# EAGLE design Development board (EAGLE 8.0.1)
CREVISION: V1; DESIGNER: Henrik K. B. Jensen

## Sheet 1 of 2
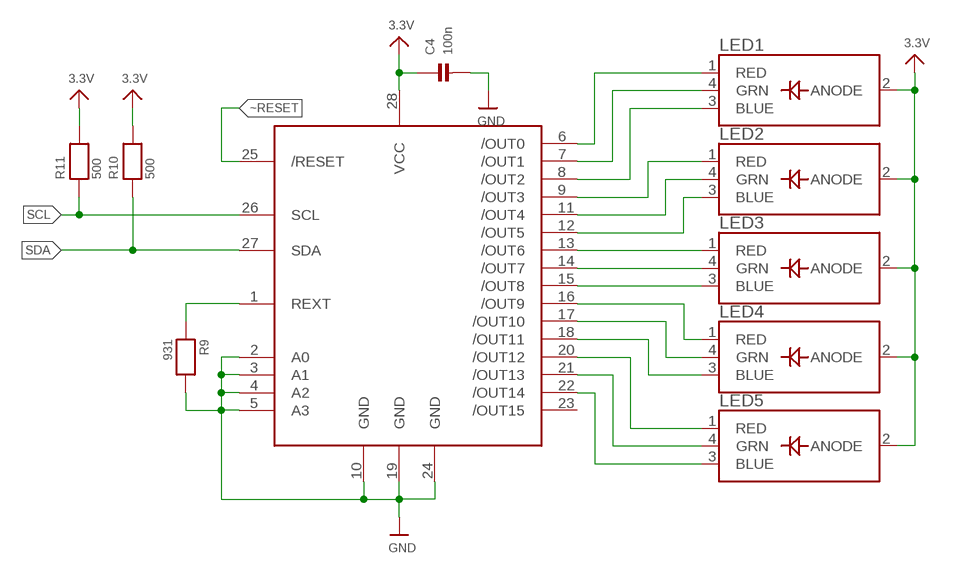
[diagram p0: schematic, sheet 1, part 1 of 3]
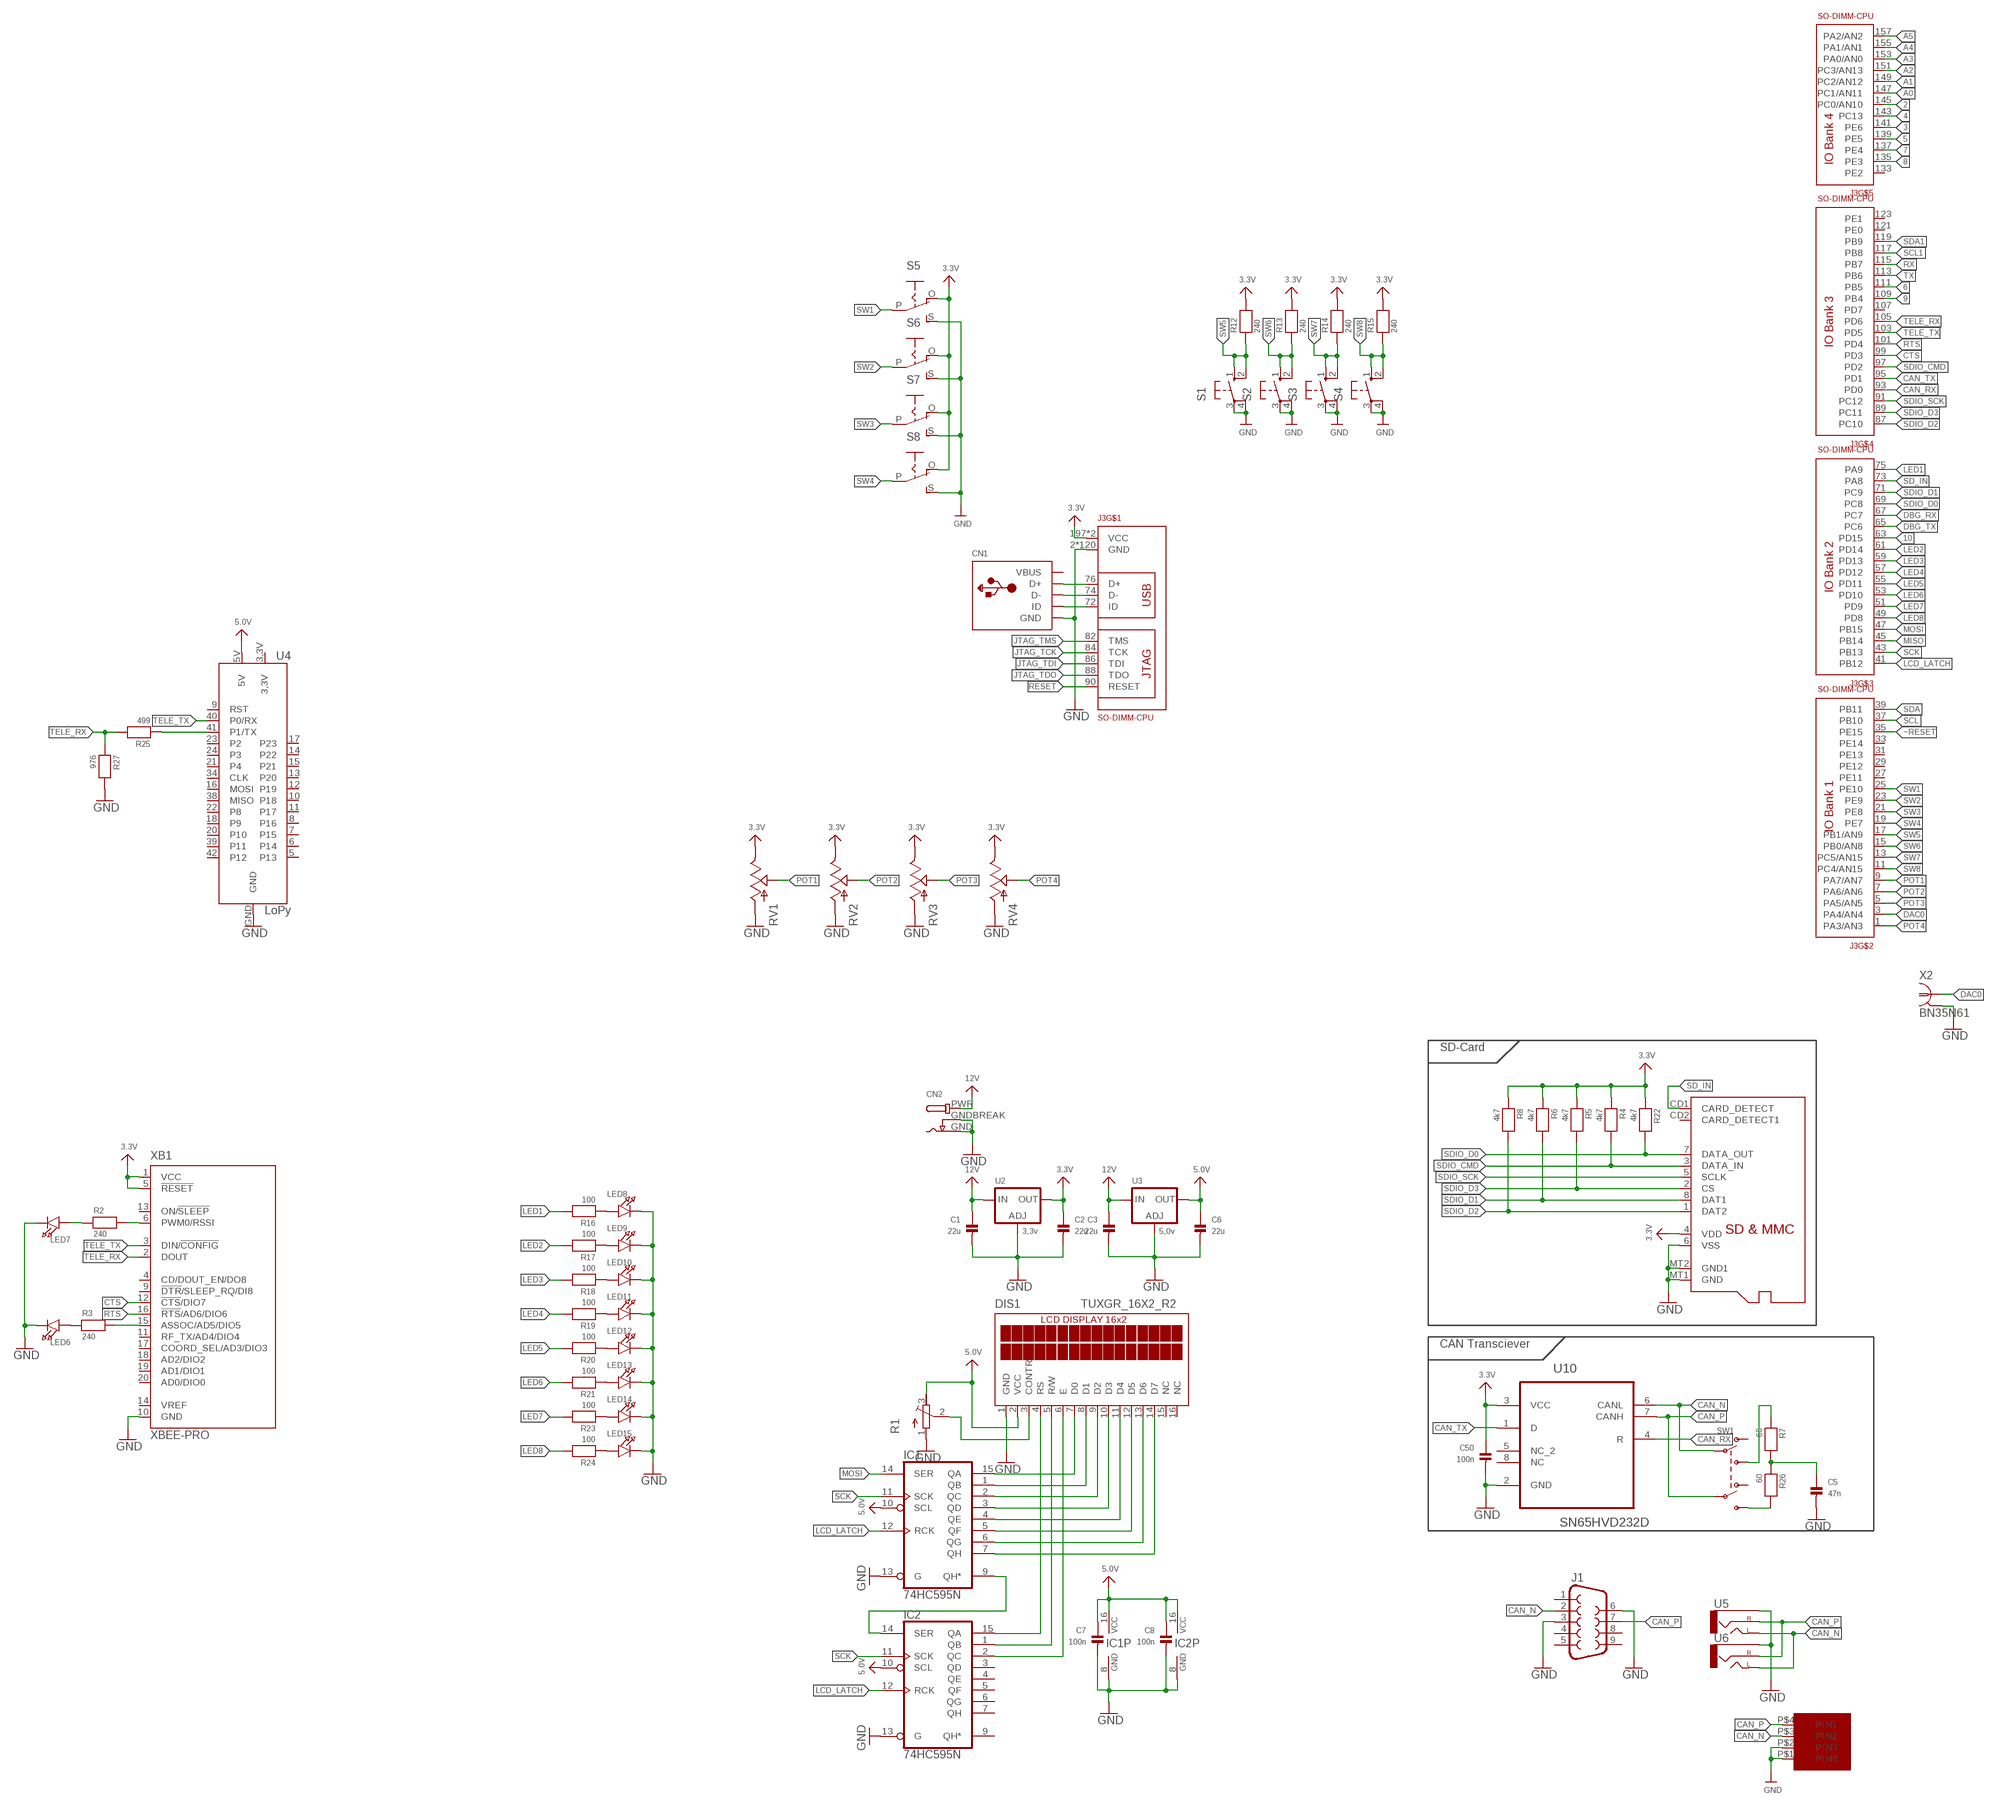
[diagram p1: schematic, sheet 1, part 2 of 3]
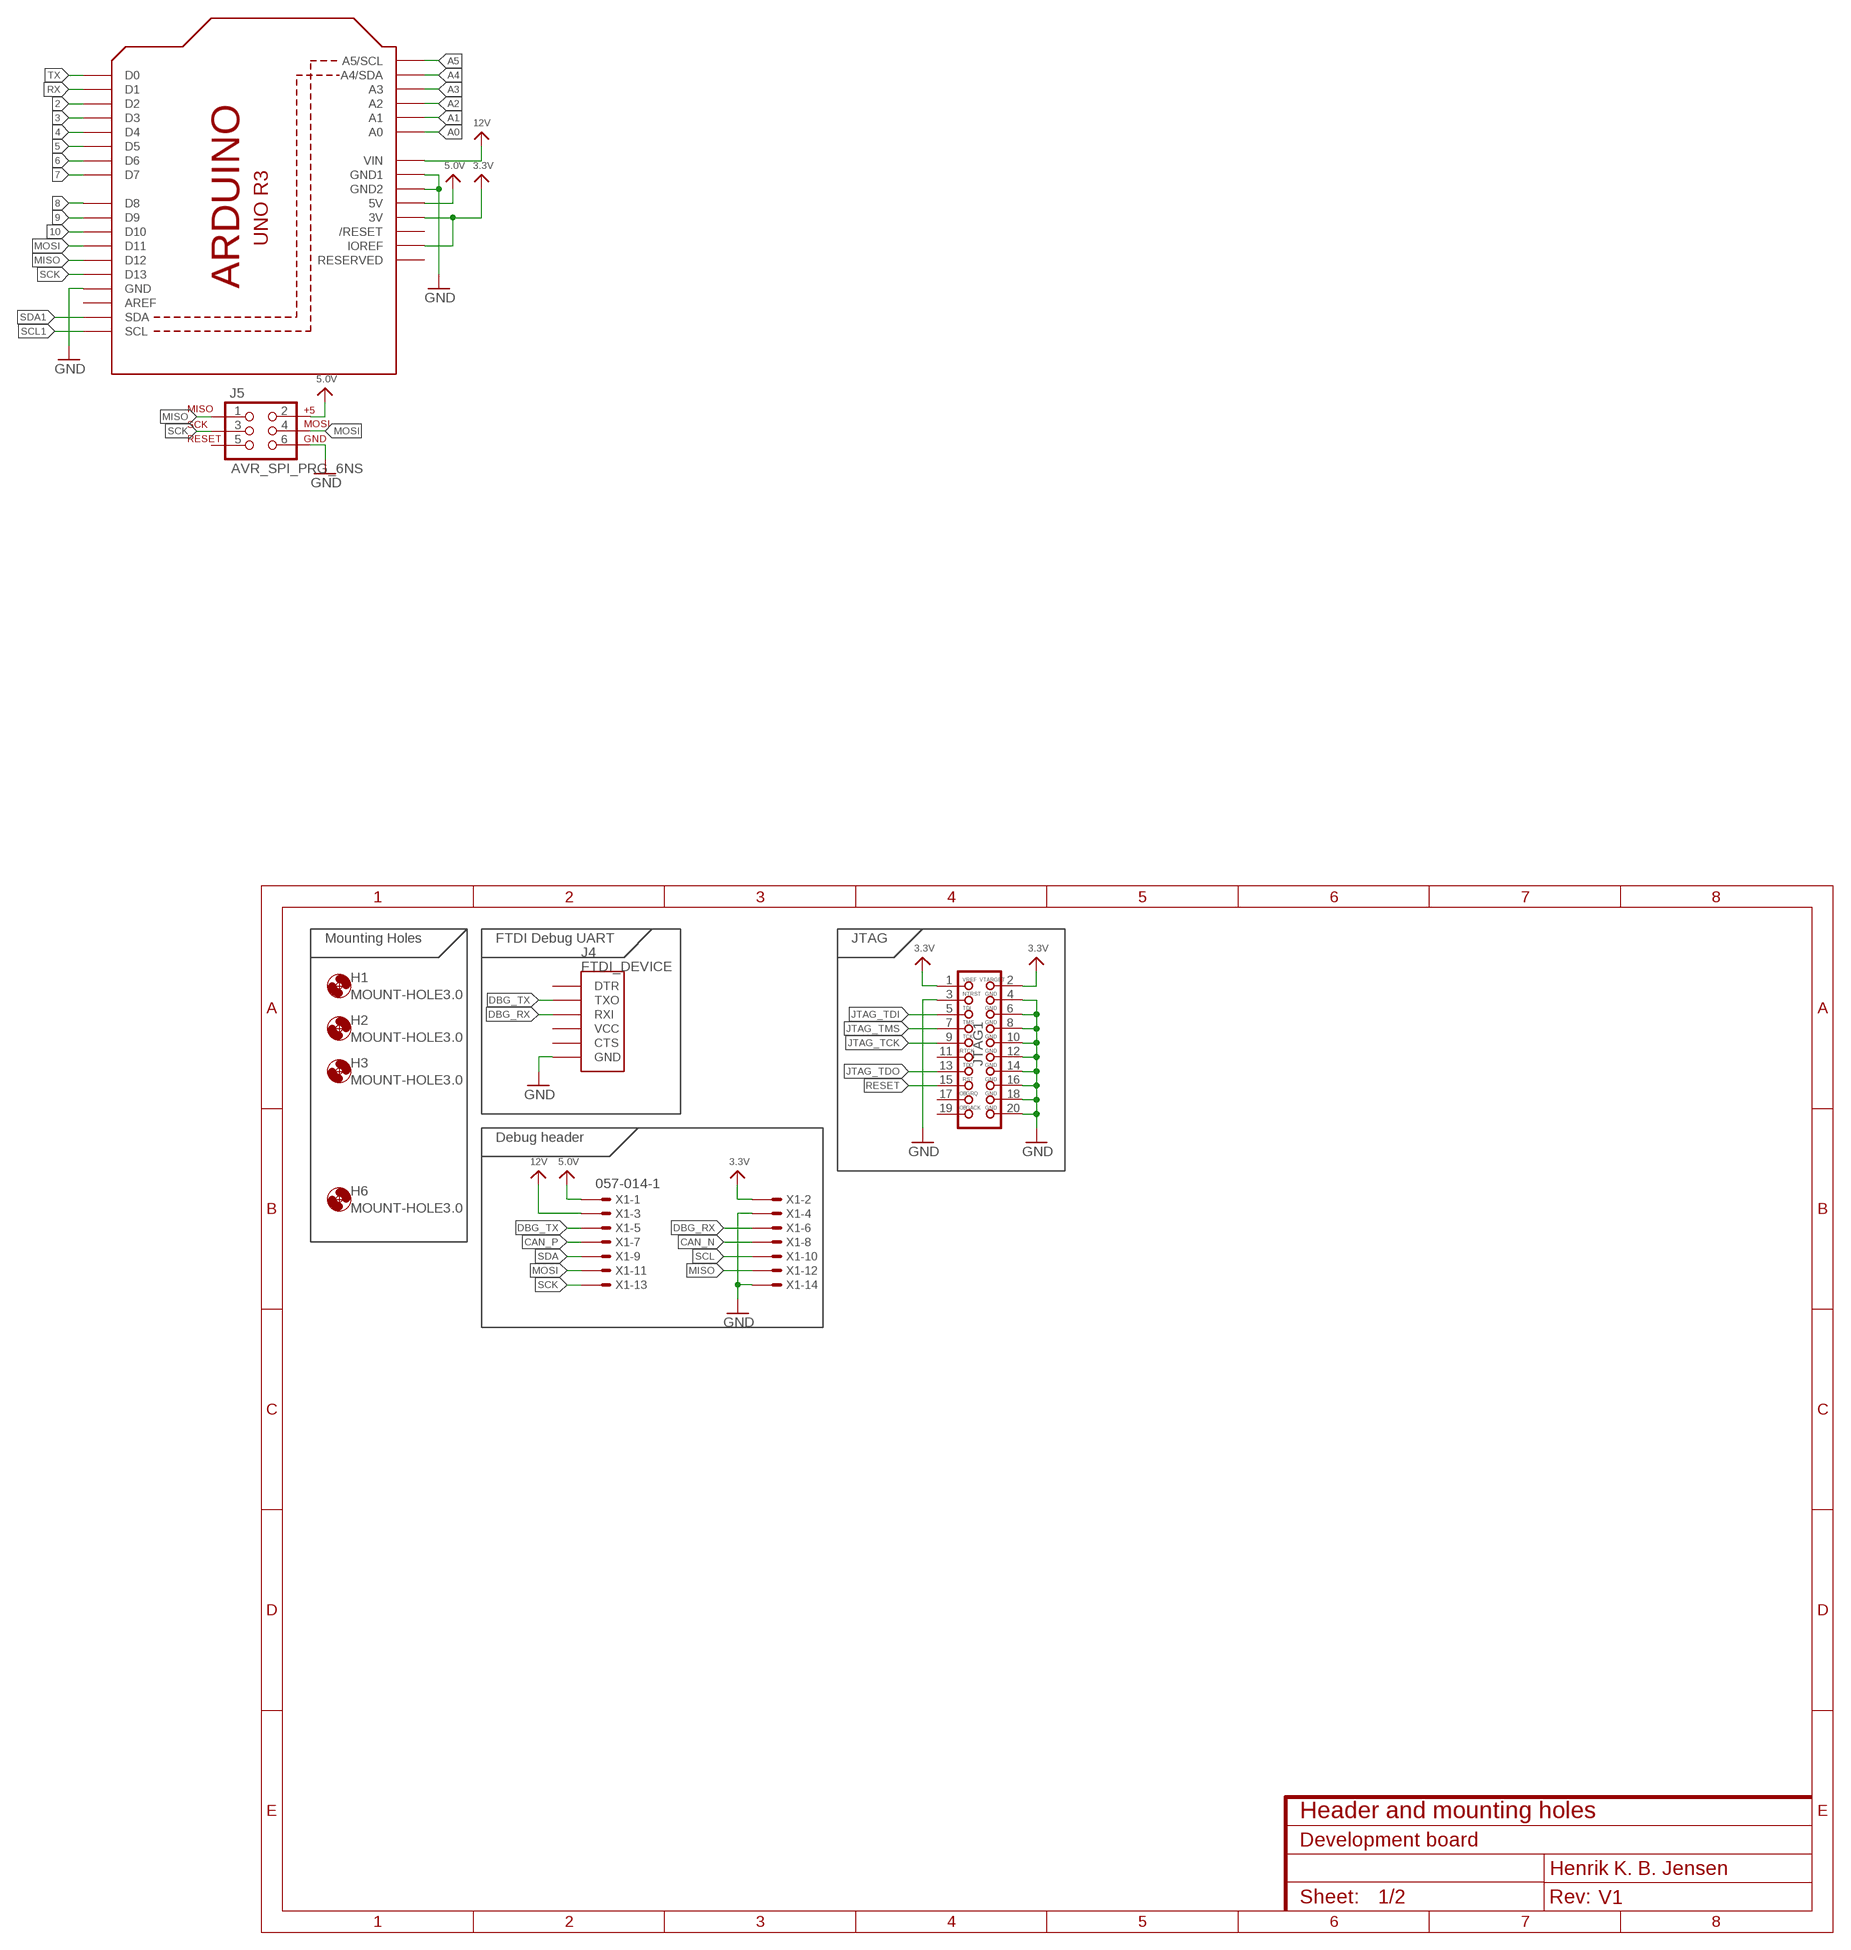
[diagram p2: schematic, sheet 1, part 3 of 3]

### Parts
C1  22u  CAP_CERAMIC_0805  [_0805]
C2  22u  CAP_CERAMIC_0805  [_0805]
C3  22u  CAP_CERAMIC_0805  [_0805]
C4  100n  CAP_CERAMIC_0603  [_0603]
C5  47n  CAP_CERAMIC_0603  [_0603]
C6  22u  CAP_CERAMIC_0805  [_0805]
C7  100n  CAP_CERAMIC_0603  [_0603]
C8  100n  CAP_CERAMIC_0603  [_0603]
C50  100n  CAP_CERAMIC_0603  [_0603]
CN1  USBMINIBLARGE  [USB-MINIB_LARGER]
CN2  DCBARRELPTH  [DCJACK_2MM_PTH]
DIS1  TUXGR_16X2_R2  [TUXGR_16X2_R2]
H1  MOUNT-HOLE3.0  [3,0]
H2  MOUNT-HOLE3.0  [3,0]
H3  MOUNT-HOLE3.0  [3,0]
H6  MOUNT-HOLE3.0  [3,0]
IC1  74HC595N  [DIL16]
IC2  74HC595N  [DIL16]
J1  DB9FEMALE  [DB9]
J3  SO-DIMM-CPU  [SODIMM-CONNECTOR-2.5V]
J4  FTDI_DEVICE  [FTDI_DEVICE_SIDE]
J5  AVR_SPI_PRG_6NS  [2X3-NS]
JTAG1  JTAG-ARM  [JTAG-ARM]
LED1  LED_RGB_PLCC4  [RGBLED_PLCC4]
LED2  LED_RGB_PLCC4  [RGBLED_PLCC4]
LED3  LED_RGB_PLCC4  [RGBLED_PLCC4]
LED4  LED_RGB_PLCC4  [RGBLED_PLCC4]
LED5  LED_RGB_PLCC4  [RGBLED_PLCC4]
LED6  LED1206  [CHIPLED_1206]
LED7  LED1206  [CHIPLED_1206]
LED8  LED1206  [CHIPLED_1206]
LED9  LED1206  [CHIPLED_1206]
LED10  LED1206  [CHIPLED_1206]
LED11  LED1206  [CHIPLED_1206]
LED12  LED1206  [CHIPLED_1206]
LED13  LED1206  [CHIPLED_1206]
LED14  LED1206  [CHIPLED_1206]
LED15  LED1206  [CHIPLED_1206]
R1  R-TRIMM3296W  [RTRIM3296W]
R2  240  RESISTOR_0603  [_0603]
R3  240  RESISTOR_0603  [_0603]
R4  4k7  RESISTOR_0603  [_0603]
R5  4k7  RESISTOR_0603  [_0603]
R6  4k7  RESISTOR_0603  [_0603]
R7  60  RESISTOR_0603  [_0603]
R8  4k7  RESISTOR_0603  [_0603]
R9  931  RESISTOR_0603  [_0603]
R10  500  RESISTOR_0603  [_0603]
R11  500  RESISTOR_0603  [_0603]
R12  240  RESISTOR_0603  [_0603]
R13  240  RESISTOR_0603  [_0603]
R14  240  RESISTOR_0603  [_0603]
R15  240  RESISTOR_0603  [_0603]
R16  100  RESISTOR_0603  [_0603]
R17  100  RESISTOR_0603  [_0603]
R18  100  RESISTOR_0603  [_0603]
R19  100  RESISTOR_0603  [_0603]
R20  100  RESISTOR_0603  [_0603]
R21  100  RESISTOR_0603  [_0603]
R22  4k7  RESISTOR_0603  [_0603]
R23  100  RESISTOR_0603  [_0603]
R24  100  RESISTOR_0603  [_0603]
R25  499  RESISTOR_0603  [_0603]
R26  60  RESISTOR_0603  [_0603]
R27  976  RESISTOR_0603  [_0603]
RV1  POT  [ALPS_POT]
RV2  POT  [ALPS_POT]
RV3  POT  [ALPS_POT]
RV4  POT  [ALPS_POT]
S1  10-XX  [B3F-10XX]
S2  10-XX  [B3F-10XX]
S3  10-XX  [B3F-10XX]
S4  10-XX  [B3F-10XX]
S5  EG1218S  [EG1218]
S6  EG1218S  [EG1218]
S7  EG1218S  [EG1218]
S8  EG1218S  [EG1218]
SW1  SWITCH_DPDT  [DPDT_SMT_JS202011SCQN]
U1  ARDUINOR3-DIMENSION  [ARDUINOR3]
U2  3,3v  LM1117SOT223-REFLOW  [SOT223-R]
U3  5,0v  LM1117SOT223-REFLOW  [SOT223-R]
U4  LoPy  LOPY  [LOPY]
U5  AUDIO-JACKPTH  [AUDIO-JACK]
U6  AUDIO-JACKPTH  [AUDIO-JACK]
U10  SN65HVD232D  [SOIC127P600X175-8N]
U$2  MICROSD  [MICROSD]
U$21  MICROFIT4  [43045-0400]
U$30  TLC59116  [TSSOP28]
X1  057-014-1  [057-014-1]
X2  BN35N61  [B35N61]
XB1  XBEE-PRO  [XBEE-PRO]

### Nets
2: J3.145(PC0/AN10) U1.D2
3: J3.141(PE6) U1.D3
3.3V: C2.1 C4.1 C50.1 J3.197(VCC) J3.199(VCC) JTAG1.1 JTAG1.2 LED1.2(ANODE) LED2.2(ANODE) LED3.2(ANODE) LED4.2(ANODE) LED5.2(ANODE) R4.1 R5.1 R6.1 R8.1 R10.2 R11.2 R12.2 R13.2 R14.2 R15.2 R22.1 RV1.P$1(E) RV2.P$1(E) RV3.P$1(E) RV4.P$1(E) S5.O S6.O S7.O S8.O U1.3V U1.IOREF U2.2(OUT) U10.3(VCC) U$2.4(VDD) U$30.28(VCC) X1.2 XB1.1(VCC) XB1.5(!RESET)
4: J3.143(PC13) U1.D4
5: J3.139(PE5) U1.D5
5.0V: C6.1 C7.1 C8.1 DIS1.2(VCC) IC1.10(SCL) IC1.16(VCC) IC2.10(SCL) IC2.16(VCC) J5.2 R1.3(E) U1.5V U3.2(OUT) U4.5V X1.1
6: J3.111(PB5) U1.D6
7: J3.137(PE4) U1.D7
8: J3.135(PE3) U1.D8
9: J3.109(PB4) U1.D9
10: J3.63(PD15) U1.D10
12V: C1.1 C3.1 CN2.PWR U1.VIN U2.3(IN) U3.3(IN) X1.3
_N: CN1.D- J3.74(D-)
_P: CN1.D+ J3.76(D+)
A0: J3.147(PC1/AN11) U1.A0
A1: J3.149(PC2/AN12) U1.A1
A2: J3.151(PC3/AN13) U1.A2
A3: J3.153(PA0/AN0) U1.A3
A4: J3.155(PA1/AN1) U1.A4(A4/SDA)
A5: J3.157(PA2/AN2) U1.A5(A5/SCL)
CAN_N: J1.2 SW1.P$2(P1) U5.TIP(LEFT) U6.TIP(LEFT) U10.6(CANL) U$21.P$3(PIN2) X1.8
CAN_P: J1.7 SW1.P$5(P2) U5.RING(RIGHT) U6.RING(RIGHT) U10.7(CANH) U$21.P$4(PIN1) X1.7
CAN_RX: J3.93(PD0) U10.4(R)
CAN_TX: J3.95(PD1) U10.1(D)
CTS: J3.99(PD3) XB1.12(!CTS!/DIO7)
DAC0: J3.3(PA4/AN4) X2.1
DBG_RX: J3.67(PC7) J4.P$3(RXI) X1.6
DBG_TX: J3.65(PC6) J4.P$2(TXO) X1.5
GND: C1.2 C2.2 C3.2 C4.2 C5.2 C6.2 C7.2 C8.2 C50.2 CN1.GND CN2.GND CN2.GNDBREAK DIS1.1(GND) IC1.8(GND) IC1.13(G) IC2.8(GND) IC2.13(G) J1.3 J1.6 J3.2(GND) J3.4(GND) J3.6(GND) J3.8(GND) J3.10(GND) J3.12(GND) J3.14(GND) J3.16(GND) J3.18(GND) J3.20(GND) J3.22(GND) J3.24(GND) J3.26(GND) J3.28(GND) J3.30(GND) J3.32(GND) J3.34(GND) J3.36(GND) J3.38(GND) J3.40(GND) J3.42(GND) J3.44(GND) J3.46(GND) J3.48(GND) J3.50(GND) J3.52(GND) J3.54(GND) J3.56(GND) J3.58(GND) J3.60(GND) J3.62(GND) J3.64(GND) J3.66(GND) J3.68(GND) J3.70(GND) J3.77(GND) J3.78(GND) J3.79(GND) J3.80(GND) J3.81(GND) J3.83(GND) J3.85(GND) J3.92(GND) J3.94(GND) J3.96(GND) J3.98(GND) J3.100(GND) J3.102(GND) J3.104(GND) J3.106(GND) J3.108(GND) J3.110(GND) J3.112(GND) J3.114(GND) J3.116(GND) J3.118(GND) J3.120(GND) J3.122(GND) J3.124(GND) J3.125(GND) J3.126(GND) J3.127(GND) J3.128(GND) J3.129(GND) J3.130(GND) J3.131(GND) J3.132(GND) J3.134(GND) J3.136(GND) J3.138(GND) J3.140(GND) J3.142(GND) J3.144(GND) J3.146(GND) J3.148(GND) J3.150(GND) J3.152(GND) J3.154(GND) J3.156(GND) J3.158(GND) J3.159(GND) J3.160(GND) J3.161(GND) J3.162(GND) J3.163(GND) J3.164(GND) J3.165(GND) J3.166(GND) J3.167(GND) J3.168(GND) J3.169(GND) J3.170(GND) J3.171(GND) J3.172(GND) J3.173(GND) J3.174(GND) J3.175(GND) J3.176(GND) J3.177(GND) J3.178(GND) J3.179(GND) J3.180(GND) J3.181(GND) J3.182(GND) J3.183(GND) J3.184(GND) J3.185(GND) J3.186(GND) J3.187(GND) J3.188(GND) J3.189(GND) J3.190(GND) J3.191(GND) J3.192(GND) J3.193(GND) J3.194(GND) J3.195(GND) J3.196(GND) J3.198(GND) J3.200(GND) J4.P$6(GND) J5.6 JTAG1.3 JTAG1.4 JTAG1.6 JTAG1.8 JTAG1.10 JTAG1.12 JTAG1.14 JTAG1.16 JTAG1.18 JTAG1.20 LED6.C LED7.C LED8.C LED9.C LED10.C LED11.C LED12.C LED13.C LED14.C LED15.C R1.1(A) R9.2 R27.2 RV1.P$3(A) RV2.P$3(A) RV3.P$3(A) RV4.P$3(A) S1.3(P) S1.4(P1) S2.3(P) S2.4(P1) S3.3(P) S3.4(P1) S4.3(P) S4.4(P1) S5.S S6.S S7.S S8.S U1.GND U1.GND1 U1.GND2 U2.1(ADJ) U3.1(ADJ) U4.GND U5.SLEEVE U6.SLEEVE U10.2(GND) U$2.6(VSS) U$2.MT1(GND) U$2.MT2(GND1) U$21.P$1(PIN4) U$21.P$2(PIN3) U$30.2(A0) U$30.3(A1) U$30.4(A2) U$30.5(A3) U$30.10(GND) U$30.19(GND) U$30.24(GND) X1.4 X1.14 X2.2(GND) XB1.10(GND)
JTAG_TCK: J3.84(TCK) JTAG1.9
JTAG_TDI: J3.86(TDI) JTAG1.5
JTAG_TDO: J3.88(TDO) JTAG1.13
JTAG_TMS: J3.82(TMS) JTAG1.7
LCD_LATCH: IC1.12(RCK) IC2.12(RCK) J3.41(PB12)
LED1: J3.75(PA9) R16.2
LED2: J3.61(PD14) R17.2
LED3: J3.59(PD13) R18.2
LED4: J3.57(PD12) R19.2
LED5: J3.55(PD11) R20.2
LED6: J3.53(PD10) R21.2
LED7: J3.51(PD9) R23.2
LED8: J3.49(PD8) R24.2
MISO: J3.45(PB14) J5.1 U1.D12 X1.12
MOSI: IC1.14(SER) J3.47(PB15) J5.4 U1.D11 X1.11
N$1: DIS1.7(D0) IC1.15(QA)
N$2: DIS1.8(D1) IC1.1(QB)
N$3: R7.1 SW1.P$3(S1)
N$4: DIS1.9(D2) IC1.2(QC)
N$5: R26.2 SW1.P$4(S2)
N$6: DIS1.10(D3) IC1.3(QD)
N$7: DIS1.11(D4) IC1.4(QE)
N$8: C5.1 R7.2 R26.1
N$9: DIS1.12(D5) IC1.5(QF)
N$10: LED1.1(RED) U$30.6(/OUT0)
N$11: DIS1.3(CONTR) R1.2(S)
N$12: LED8.A R16.1
N$13: LED1.4(GRN) U$30.7(/OUT1)
N$14: LED1.3(BLUE) U$30.8(/OUT2)
N$15: LED9.A R17.1
N$16: LED6.A R3.1
N$17: R3.2 XB1.15(ASSOC/AD5/DIO5)
N$18: R2.2 XB1.6(PWM0/RSSI)
N$19: LED7.A R2.1
N$20: LED2.1(RED) U$30.9(/OUT3)
N$21: LED2.4(GRN) U$30.11(/OUT4)
N$22: LED2.3(BLUE) U$30.12(/OUT5)
N$23: DIS1.13(D6) IC1.6(QG)
N$24: DIS1.14(D7) IC1.7(QH)
N$25: LED10.A R18.1
N$26: LED11.A R19.1
N$27: IC1.9(QH*) IC2.14(SER)
N$28: DIS1.4(RS) IC2.15(QA)
N$29: LED3.1(RED) U$30.13(/OUT6)
N$30: LED3.4(GRN) U$30.14(/OUT7)
N$31: LED12.A R20.1
N$32: LED3.3(BLUE) U$30.15(/OUT8)
N$33: LED4.1(RED) U$30.16(/OUT9)
N$34: LED4.4(GRN) U$30.17(/OUT10)
N$35: LED4.3(BLUE) U$30.18(/OUT11)
N$36: LED5.1(RED) U$30.20(/OUT12)
N$37: DIS1.5(R/W) IC2.1(QB)
N$38: LED5.4(GRN) U$30.21(/OUT13)
N$39: LED5.3(BLUE) U$30.22(/OUT14)
N$40: DIS1.6(E) IC2.2(QC)
N$41: LED13.A R21.1
N$42: LED14.A R23.1
N$43: LED15.A R24.1
N$46: R25.1 U4.41(P1/TX)
N$53: R9.1 U$30.1(REXT)
N$79: CN1.ID J3.72(ID)
POT1: J3.9(PA7/AN7) RV1.P$2(S)
POT2: J3.7(PA6/AN6) RV2.P$2(S)
POT3: J3.5(PA5/AN5) RV3.P$2(S)
POT4: J3.1(PA3/AN3) RV4.P$2(S)
RESET: J3.90(RESET) JTAG1.15
RTS: J3.101(PD4) XB1.16(!RTS!/AD6/DIO6)
RX: J3.115(PB7) U1.D1
SCK: IC1.11(SCK) IC2.11(SCK) J3.43(PB13) J5.3 U1.D13 X1.13
SCL: J3.37(PB10) R11.1 U$30.26(SCL) X1.10
SCL1: J3.117(PB8) U1.SCL
SD_IN: J3.73(PA8) U$2.CD1(CARD_DETECT)
SDA: J3.39(PB11) R10.1 U$30.27(SDA) X1.9
SDA1: J3.119(PB9) U1.SDA
SDIO_CMD: J3.97(PD2) R4.2 U$2.3(DATA_IN)
SDIO_D0: J3.69(PC8) R22.2 U$2.7(DATA_OUT)
SDIO_D1: J3.71(PC9) R6.2 U$2.8(DAT1)
SDIO_D2: J3.87(PC10) R8.2 U$2.1(DAT2)
SDIO_D3: J3.89(PC11) R5.2 U$2.2(CS)
SDIO_SCK: J3.91(PC12) U$2.5(SCLK)
SW1: J3.25(PE10) S5.P
SW2: J3.23(PE9) S6.P
SW3: J3.21(PE8) S7.P
SW4: J3.19(PE7) S8.P
SW5: J3.17(PB1/AN9) R12.1 S1.1(S) S1.2(S1)
SW6: J3.15(PB0/AN8) R13.1 S2.1(S) S2.2(S1)
SW7: J3.13(PC5/AN15) R14.1 S3.1(S) S3.2(S1)
SW8: J3.11(PC4/AN15) R15.1 S4.1(S) S4.2(S1)
TELE_RX: J3.105(PD6) R25.2 R27.1 XB1.2(DOUT)
TELE_TX: J3.103(PD5) U4.40(P0/RX) XB1.3(DIN/!CONFIG)
TX: J3.113(PB6) U1.D0
~RESET: J3.35(PE15) U$30.25(/RESET)
Unconnected: DIS1.15(NC) DIS1.16(NC) IC2.3(QD) IC2.4(QE) IC2.5(QF) IC2.6(QG) IC2.7(QH) IC2.9(QH*) J1.1 J1.4 J1.5 J1.8 J1.9 J3.27(PE11) J3.29(PE12) J3.31(PE13) J3.33(PE14) J3.107(PD7) J3.121(PE0) J3.123(PE1) J3.133(PE2) J4.P$1(DTR) J4.P$4(VCC) J4.P$5(CTS) J5.5 JTAG1.11 JTAG1.17 JTAG1.19 SW1.P$1(O1) SW1.P$6(O2) U1.AREF U1.RESERVED U1.RESET(/RESET) U4.3,3V U4.5(P13) U4.6(P14) U4.7(P15) U4.8(P16) U4.9(RST) U4.10(P18) U4.11(P17) U4.12(P19) U4.13(P20) U4.14(P22) U4.15(P21) U4.16(MOSI) U4.17(P23) U4.18(P9) U4.20(P10) U4.21(P4) U4.22(P8) U4.23(P2) U4.24(P3) U4.34(CLK) U4.38(MISO) U4.39(P11) U4.42(P12) U10.5(NC_2) U10.8(NC) U$2.CD2(CARD_DETECT1) U$30.23(/OUT15) XB1.4(CD/DOUT_EN/DO8) XB1.9(!DTR!/SLEEP_RQ/DI8) XB1.11(RF_TX/AD4/DIO4) XB1.13(ON/!SLEEP) XB1.14(VREF) XB1.17(COORD_SEL/AD3/DIO3) XB1.18(AD2/DIO2) XB1.19(AD1/DIO1) XB1.20(AD0/DIO0)

### Notes on the sheet
- Mounting Holes | FTDI Debug UART | JTAG
- Debug header
- SD-Card
- CAN Transciever
- Header and mounting holes

## Sheet 2 of 2
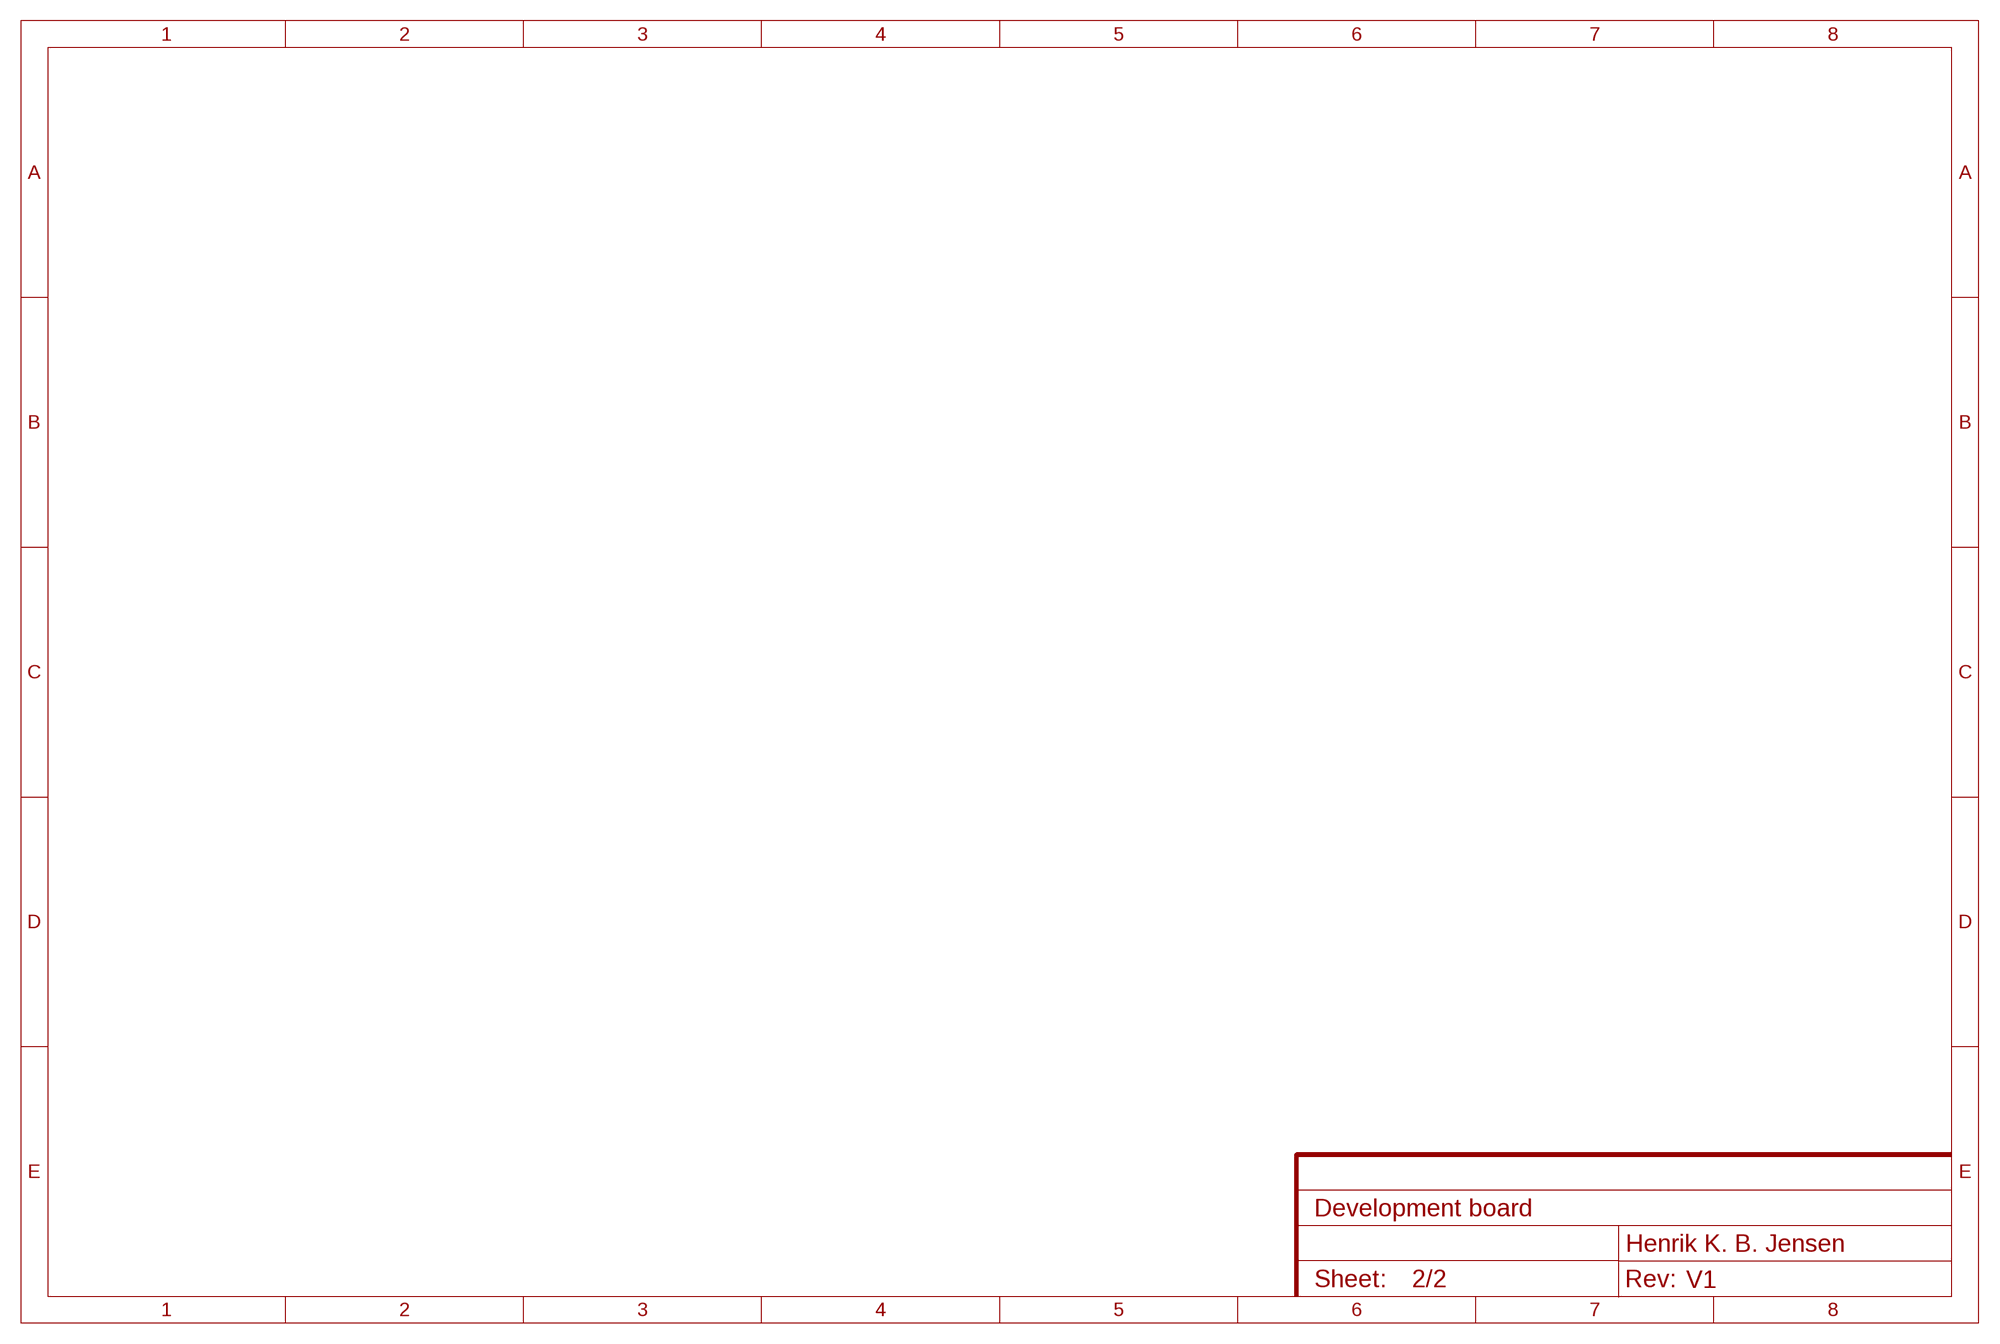
[diagram p3: schematic, sheet 2]

## Power pins joined to a net without a drawn wire
GND: X2.3(GND) X2.4(GND) X2.5(GND)
VBUS: CN1.VBUS

## Library data of the parts
C1-C8 C50 = microbuilder:CAP_CERAMIC: Ceramic Capacitors 0402 - 0402 Surface Mount Capacitors 16pF 50V 5% [Digikey: 445-4899-2-ND] 18pF 50V 5% [Digikey: 490-1281-2-ND] 22pF 50V 5% [Digikey: 490-1283-2-ND] 68pF 50V 5% [Digikey: 490-1289-2-ND] 0.1uF 10V 10% [Digikey: 490-1318-2-ND] 1.0uF 6.3V 10% [Digikey: 490-1320-2-ND] 0603 - 0603 Surface Mount Capacitors 16 pF 50V 5% [Digikey: 445-5051-2-ND] 22 pF 50V [Digikey: PCC220ACVTR-ND] 33 pF 50V 5% [Digikey: 490-1415-1-ND] 56pF 50V 5% [Digikey: 490-1421-1-ND] 220pF 50V 5% [Digikey: 445-1285-1-ND] 680 pF 50V 2200 pF 50V 5% C0G [Digikey: 445-1297-1-ND] 5600 pF 100V 5% X7R [Digikey: 478-3711-1-ND] 0.1 µF 25V 10% [Digikey: PCC2277TR-ND] 0.22 µF 16V 10% X7R [Digikey: 445-1318-1-ND] 1.0 µF 25V 10% [Digikey: 445-5146-2-ND] 0603 - RF Specific 3pF 250V +/-0.1pF RF [Digikey: 712-1347-1-ND] 18 pF 250V 5% [Digikey: 478-3505-1-ND or 712-1322-1-ND] 56 pF 250V 5% C0G RF [Digikey: 490-4867-1-ND] 68 pF 250V RF [Digikey: 490-4868-1-ND] 0805 - 0805 Surface Mount Capacitors 220 pF 250V 2% RF Ceramic Capacitor [Digikey: 712-1398-1-ND] 1000 pF 50V 2% NP0 Ceramic Capacitor [Digikey: 478-3760-1-ND] 0.1 µF 25V 10% Ceramic Capacitor [Digikey: PCC1828TR-ND] 1.0 µF 16V 10% Ceramic Capacitor[Digikey: 490-1691-2-ND] 10.0 µF 10V 10% Ceramic Capacitor[Digikey: 709-1228-1-ND] 10.0 uF 16V 10% Ceramic Capacitor [Digikey: 478-5165-2-ND] 47 uF 6.3V 20% Ceramic Capacitor [Digikey: 587-1779-1-ND or 399-5506-1-ND] 1206 - 1206 Surface Mount Capacitors 47uF 10V 20% Ceramic Capacitor [Digikey: 490-5528-1-ND or 399-5508-1-ND or 445-6010-1-ND] 100uF 6.3V -20%, +80% Y5V Ceramic Capacitor (Digikey: 490-4512-1-ND, Mouser: 81-GRM31CF50J107ZE1L)
CN1 = microbuilder:USB: USB Connectors USBMINIB - Surface Mount Female Mini-B USB Connector 4UConnector: 06564
CN2 = microbuilder:DCBARREL: DC Barrel Jack DCJACK_1.3MM_PTH - Through Hole 1.3mm Jack (4UConnector: 05536) DCJACK_2MM_PTH - Through Hole 2.0/2.1 Jack (4UConnector: 05537) DCJACK_2MM_SMT - SMT 2.0/2.1mm Jack(4UConnector: 03267)
DIS1 = display-lcd:TUXGR_16X2_R2: Tuxgraphics LCD display 16x2 characters reflective, without background light Source: tuxgr_12x2_r2.pdf; OC_FARNELL: unknown; OC_NEWARK: unknown
H1-H3 H6 = holes:MOUNT-HOLE: MOUNTING HOLE with drill center marker
IC1 IC2 = 74xx-eu:74*595: 8-bit SHIFT REGISTER, output latch
J1 = SparkFun-Connectors:DB9: DB9 Connector Standard DB9 (D-Sub 9) serial connector. Can be used for CAN bus as well as RS485 and RS232. Footprint production proven. Spark Fun Electronics SKU : PRT-00429; PROD_ID: CONN-08194
J3 = AAU-Racing:SO-DIMM-CPU
J4 = SparkFun-Connectors:FTDI_DEVICE: Connector which mates to FTDI basic or FTDI cable.
J5 = SparkFun-Connectors:AVR_SPI_PRG_6: AVR ISP 6 Pin This is the reduced ISP connector for AVR programming. Common on Arduino. This footprint will take up less PCB space and can be used with a 10-pin to 6-pin adapter such as SKU: BOB-08508 **Special note about "TEST_POINT" package. The stop mask is on the top side, so if you want your programming test points to be on the bottom of your board, make sure to place this package on the bottom side of the board. This also ensure that the orientation to program from the bottom side will be correct.
JTAG1 = microbuilder:JTAG-ARM: 20 Pin JTAG Connector For use with ARM7, and ARM9. Supported by some Cortex M3 boards with SWJ-DP interfaces (dual SWP/JTAG support). 4UConnector: 03556
LED1-LED5 = microbuilder:LED_RGB_PLCC4: RGB LED - PLCC4 Cree 20mA Common Anode Digikey: CLV1A-FKB-CJ1M1F1BB7R4S3CT-ND Red: 2.6V Vf, 550mcd Green: 3.2V Vf, 850mcd Blue: 3.2V Vf, 320mcd
LED6-LED15 = microbuilder:LED: LED 0603 - 0603 Surface Mount Package 2mA: Green LED - Low Power (3.9mcd, 2ma, 1.7Vf) - Digikey: 475-2709-2-ND Orange LED - Low Power (9.8mcd, 2ma, 1.8Vf) - Digikey: 475-1194-2-ND Red LED - Low Power (5mcd, 2ma, 1.8Vf) - Digikey: 475-1195-2-ND Yellow LED - Low Power (7mcd, 2ma, 1.8Vf) - Digikey: 475-1196-2-ND 5mA: Blue LED - Low Power (17mcd, 5ma, 2.9Vf) - Digikey: LNJ937W8CRACT-ND 0805 - 0805 Surface Mount Package 2mA: Red LED (8.8mcd, 2mA, 1.8Vf, Clear) - Low Power [Digikey: 475-2510-1-ND] Green LED (5mcd, 2mA, 1.8Vf, Clear) - Low Power [Digikey: 475-2730-1-ND] Yellow LED (11.3mcd, 2mA, 1.8Vf, Clear) - Low Power [Digikey: 475-2555-1-ND] 20mA: Red LED (104mcd, 20mA, Diffused) - LS R976 [Digikey: 475-1278-6-ND] Red LED (12mcd, 20mA, 2.0Vf, Clear) - APT2012EC [Digikey: 754-1128-1-ND] Green LED (15mcd, 20mA, 2.2Vf, Clear) - APT2012GC [Digikey: 754-1131-1-ND] Orange LED (160mcd, 20mA, 2.1Vf, Clear) - APT2012SECK [Digikey: 754-1130-1-ND] 1206 - 1206 Surface Mount Package Green LED (26mcd, 20mA, Diffused) - LG N971 [Digikey: 475-1407-6-ND] Red LED (15mcd, 20mA, Diffused) - LH N974 [Digikey: 475-1416-6-ND]
R1 = rcl:R-TRIMM: Trimm resistor
R2-R27 = microbuilder:RESISTOR: Resistors 0402 - 0402 Surface Mount Package 22 Ohm 1% 1/16W [Digikey: 311-22.0LRTR-ND] 33 Ohm 5% 1/16W 1.0K 5% 1/16W 1.5K 5% 1/16W 2.0K 1% 1/16W 10.0K 1% 1/16W [Digikey: 311-10.0KLRTR-ND] 10.0K 5% 1/16W [Digikey: RMCF0402JT10K0TR-ND] 12.1K 1% 1/16W [Digikey: 311-22.0LRTR-ND] 100.0K 5% 1/16W 0603 - 0603 Surface Mount Package 0 Ohm 1/10 Watt 1% Resistor 15 Ohm 1/10 Watt 1% Resistor 33 Ohm 1/10 Watt 1% Resistor 49.9 Ohm 1/10 Watt 1% Resistor 100 Ohm 1/10 Watt 1% Resistor 150 Ohm 1/10 Watt 1% Resistor 240 Ohm 1/10 Watt 1% Resistor 390 Ohm 1/10 Watt 1% Resistor 560 Ohm 1/10 Watt 1% Resistor 680 Ohm 1/10 Watt 1% Resistor 750 Ohm 1/10 Watt 1% Resistor 1.0K Ohm 1/10 Watt 1% Resistor 1.5K Ohm 1/10 Watt 1% Resistor 2.0K Ohm 1/10 Watt 1% Resistor 2.2K Ohm 1/10 Watt 1% Resistor 3.3K Ohm 1/10 Watt 1% Resistor 4.7K Ohm 1/10 Watt 1% Resistor 10.0K Ohm 1/10 Watt 1% Resistor 12.0K Ohm 1/10 Watt 1% Resistor 12.1K Ohm 1/10 Watt 1% Resistor 20.0K Ohm 1/10 Watt 1% Resistor 33.0K Ohm 1/10 Watt 1% Resistor 100.0K Ohm 1/10 Watt 1% Resistor 0805 - 0805 Surface Mount Package 0 Ohm 1/8 Watt 1% Resistor 33 Ohm 1/8 Watt 1% Resistor 100 Ohm 1/8 Watt 1% Resistor 150 Ohm 1/8 Watt 1% Resistor 200 Ohm 1/8 Watt 1% Resistor 240 Ohm 1/8 Watt 1% Resistor 330 Ohm 1/8 Watt 1% Resistor 390 Ohm 1/8 Watt 1% Resistor 470 Ohm 1/8 Watt 1% Resistor 1.0K Ohm 1/8 Watt 1% Resistor 1.5K Ohm 1/8 Watt 1% Resistor 2.0K Ohm 1/8 Watt 1% Resistor 4.7K Ohm 1/8 Watt 1% Resistor 5.1K Ohm 1/8 Watt 1% Resistor 5.6K Ohm 1/8 Watt 1% Resistor 10.0K Ohm 1/8 Watt 1% Resistor 22.0K Ohm 1/8 Watt 1% Resistor 33.0K Ohm 1/8 Watt 1% Resistor 100K Ohm 1/8 Watt 1% Resistor 1206 - 1206 Surface Mount Package 2012 - 2010 Surface Mount Package 0.11 Ohm 1/2 Watt 1% Resistor - Digikey: RHM.11UCT-ND
RV1-RV4 = SparkFun-Electromechanical:POT; PROD_ID: RES-09177
S1-S4 = switch-omron:10-XX: OMRON SWITCH; MPN: B3F-1000; OC_FARNELL: 176432; OC_NEWARK: 36M3542
S5-S8 = adafruit:EG1218: SLIDING SWITCH 0.1" spacing through hole, vertical SPDT slide switch http://www.ladyada.net/library/pcb/eaglelibrary.html
SW1 = microbuilder:SWITCH_DPDT: Switch - DPDT A DPDT Switch acts like an SPDT switch, but has a pair of switches instead of just one. Vertical - 0.3A @ 6V SMT - Digikey: JS202011SCQN
U1 = microbuilder:ARDUINOR3: This is a new object for the new Arduino R3 - with extra pins that you may want to use (such as IOref, and duplicated A4/A5
U2 U3 = microbuilder:LM1117: LM1117 Voltage Regulator LM1117 Adjustable Voltage regulator [Digikey: LM1117IMP-ADJDKR-ND] LM1117 3.3V Voltage regulator [AP1117E33GDIDKR-ND] LM1117 5.0V Voltage regulator [AP1117E50GDIDKR-ND] SOT223-REFLOW - SOT223 package for solder paste/reflow ovens SOT223-WAVE - SOT223 package for hand-soldering (larger pads) Note: For the fixed-voltage regulators, simply set the ADJ pin to GND.
U4 = AAU-Racing:LOPY
U5 U6 = connector:AUDIO-JACK: 3.5mm Audio Jack Simple 3.5mm common PCB mount audio jack.; DIGIKEY: CP1-3524N-ND
U10 = Texas Instruments_By_element14_Batch_1:SN65HVD232D: 3.3-V CAN TRANSCEIVERS; MPN: SN65HVD232D; OC_FARNELL: 1103107; OC_NEWARK: 35K4890; PACKAGE: SOIC-8; SUPPLIER: Texas Instruments
U$2 = adafruit:MICROSD: Micro-SD / Transflash card holder with SPI pinout For the 3M # 2908-05WB-MG and/or 4UCON #19656 push-push type
U$21 = unicorn:MICROFIT4
U$30 = tlc:TLC59116
X1 = con-panduit:057-014-: CONNECTOR 10-pin series 057 contact pc board low profile headers
X2 = con-coax:BN35N61: BNC CONNECTOR M/A COM www.macom.com distributor Farnell 149-452; OC_FARNELL: unknown; OC_NEWARK: unknown
XB1 = maxstream:XBEE: XBee (TM) /XBee-PRO(TM) OEM RF Modules Source: MaxStream, Inc. xbee_productmanual.pdf; MPN: XBP24-AWI-001; OC_FARNELL: 1337916; OC_NEWARK: 42M2667

## Board
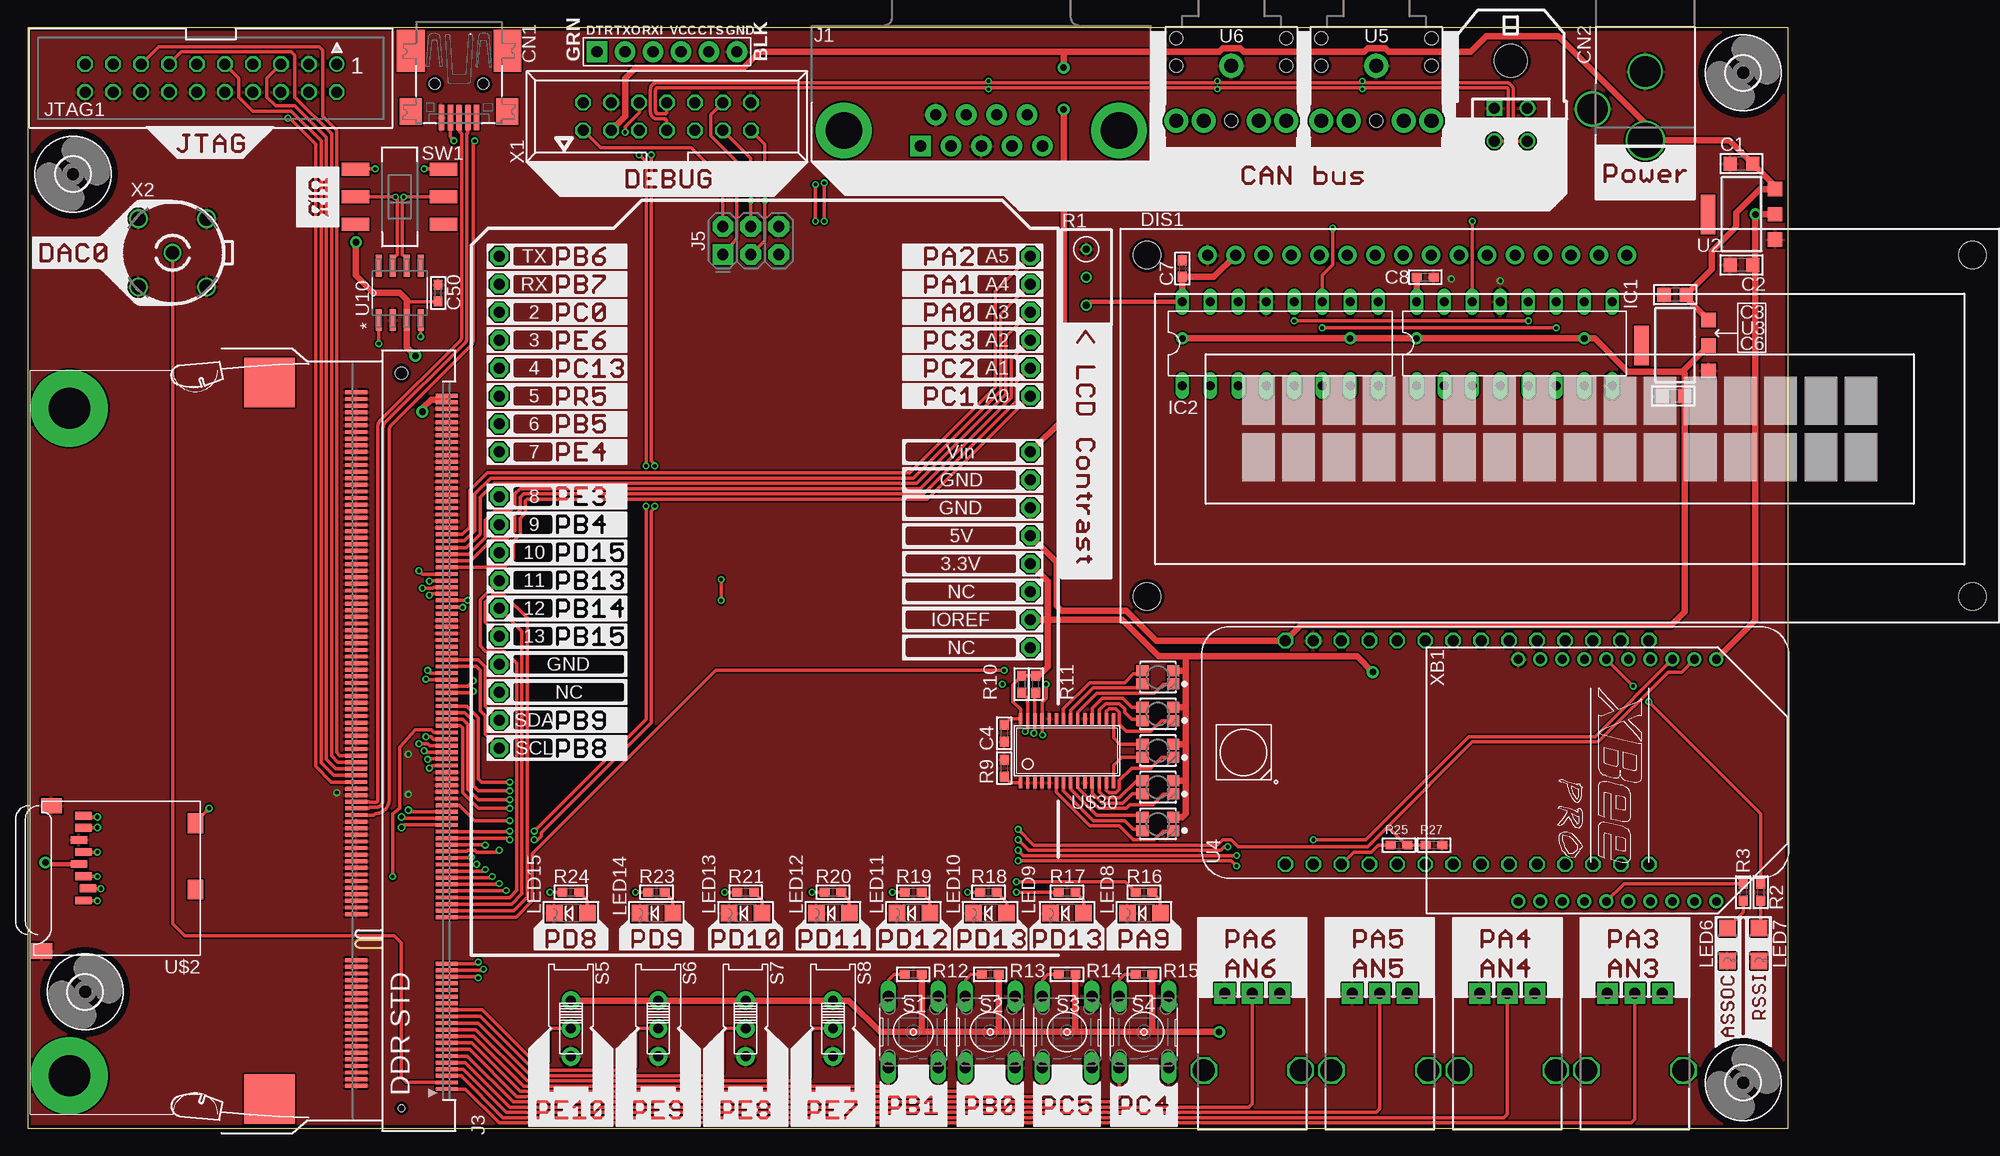
[diagram p4: board, top side]
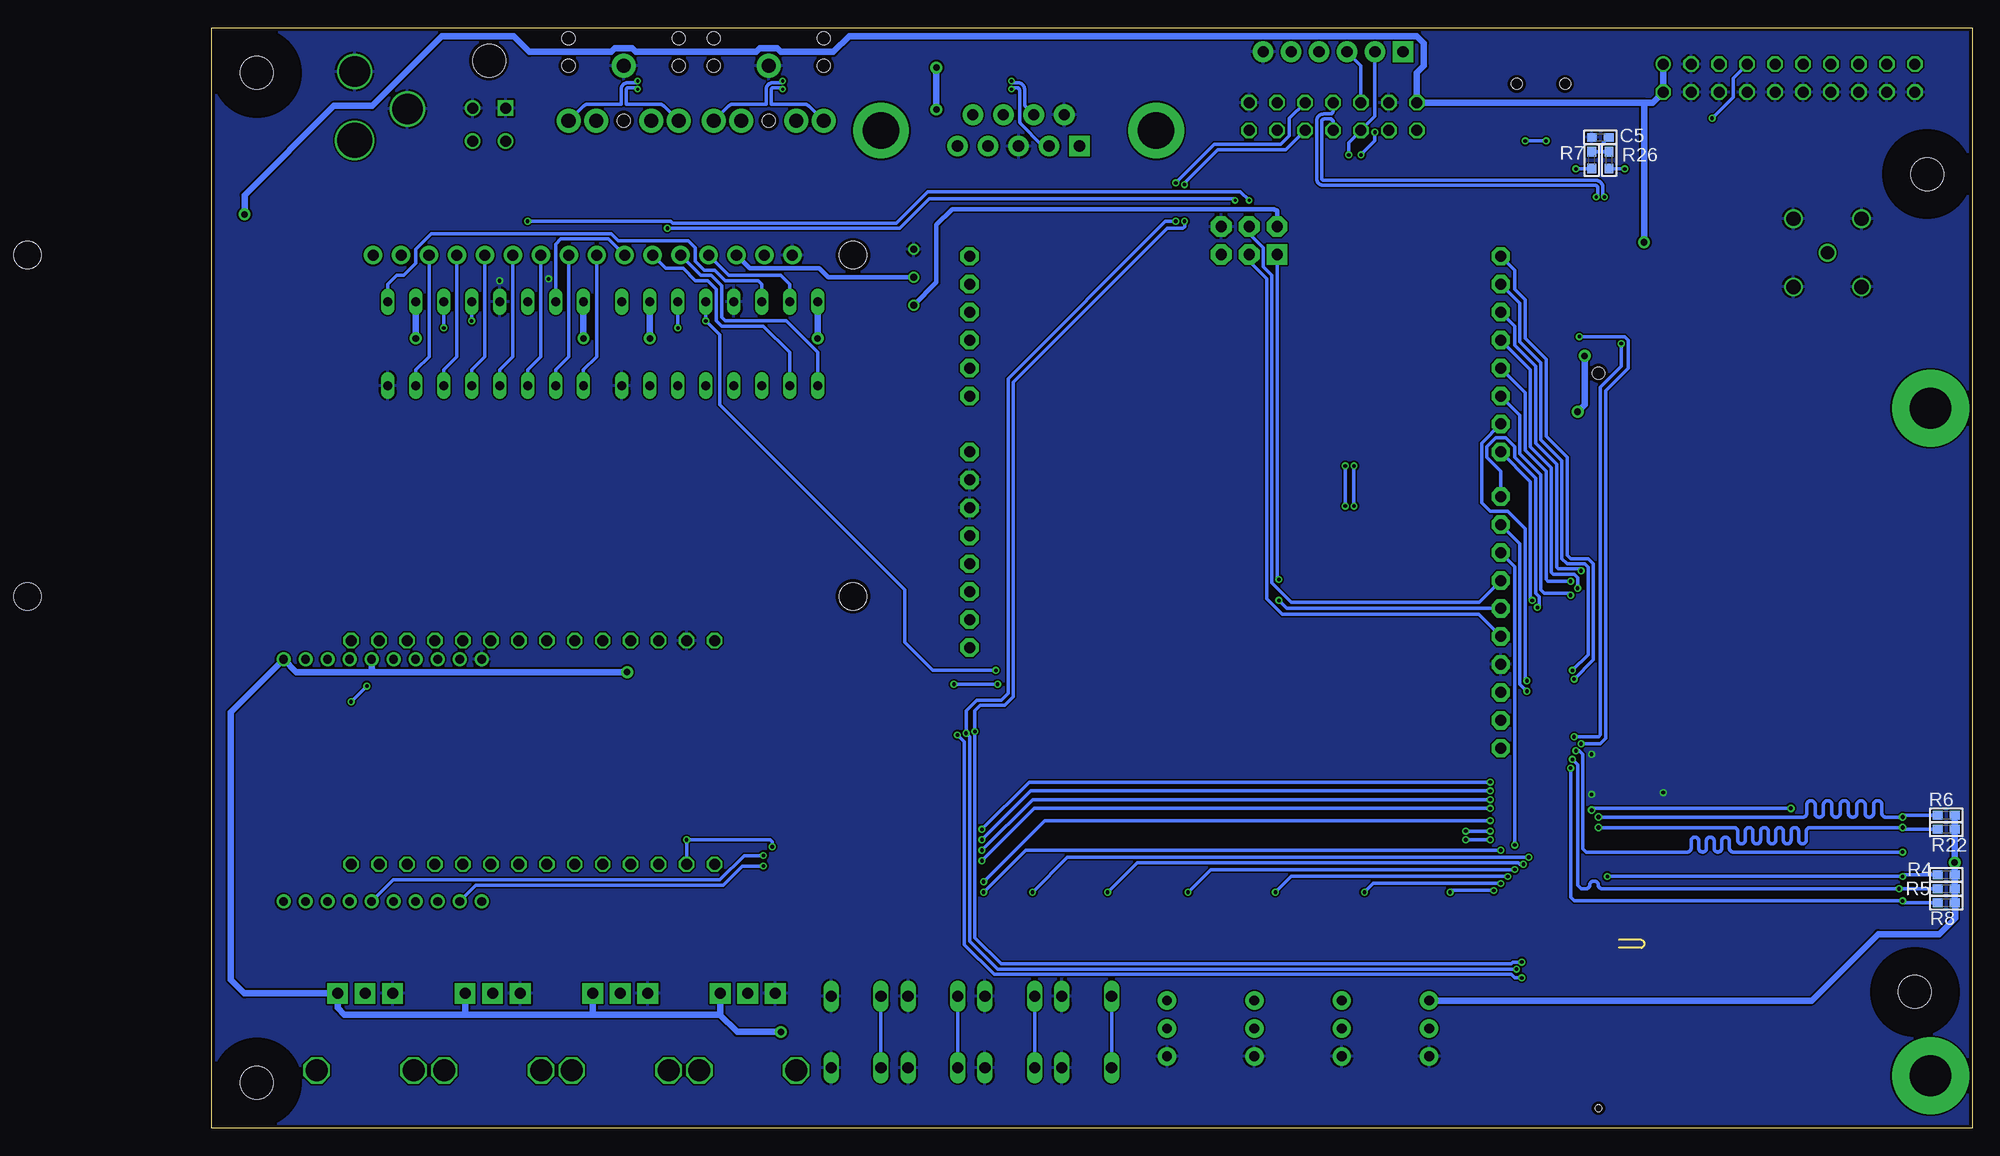
[diagram p5: board, bottom side, seen from below]

Size 160 x 100 mm. Coordinates in mm from the lower left corner, seen from the top.
Outline: 0,0 160,0 160,100 0,100 0,0
Copper layers (1*16): Top 0.035mm / dielectric 1.5mm / Bottom 0.035mm
Design rules "PCB-POOL Standard": minimum track width 0.15mm, minimum drill 0.3mm, track to track 0.15mm, track to pad 0.15mm, pad to pad 0.15mm, via to via 0.15mm, smd to smd 0.15mm, copper to edge 0.3mm, drill to drill 0.2mm, minimum pad ring 0.2mm, minimum via ring 0.15mm, stop-mask expansion 0.075mm, vias tented up to drill 0mil, thermal gap 0.2mm

### Footprints (pad centres in the part's own frame; a part is rotated, then mirrored left to right if it is on the bottom)
_0805 = smd 1.2 x 1.3: 1 -1.016,0; 2 1.016,0
_0603 = smd 0.9 x 0.8: 1 -0.762,0; 2 0.762,0
USB-MINIB_LARGER = smd 0.5 x 2.308: D+ 0,4.064; D- -0.8,4.064; GND 1.6,4.064; ID 0.8,4.064; VBUS -1.6,4.064 | smd 2.54 x 3.81: GND1 -4.4,-2; GND4 4.4,-2 | smd 2 x 2.4: GND2 -4.4,3.5; GND3 4.4,3.5 | hole 1: -2.2,1; 2.2,1
DCJACK_2MM_PTH = drill 2.8: GND 0,7.35; GNDBREAK 4.8,10.75 | drill 3.2: PWR 0,13.6
TUXGR_16X2_R2 = drill 1 pad 1.676: 1 -32,15.5; 2 -29.46,15.5; 3 -26.92,15.5; 4 -24.38,15.5; 5 -21.84,15.5; 6 -19.3,15.5; 7 -16.76,15.5; 8 -14.22,15.5; 9 -11.68,15.5; 10 -9.14,15.5; 11 -6.6,15.5; 12 -4.06,15.5; 13 -1.52,15.5; 14 1.02,15.5; 15 3.56,15.5; 16 6.1,15.5 | hole 2.5: -37.5,-15.5; 37.5,-15.5; -37.5,15.5; 37.5,15.5
3,0 = hole 3: 0,0
DIL16 = drill 0.813 long: 1 -8.89,-3.81; 2 -6.35,-3.81; 3 -3.81,-3.81; 4 -1.27,-3.81; 5 1.27,-3.81; 6 3.81,-3.81; 7 6.35,-3.81; 8 8.89,-3.81; 9 8.89,3.81; 10 6.35,3.81; 11 3.81,3.81; 12 1.27,3.81; 13 -1.27,3.81; 14 -3.81,3.81; 15 -6.35,3.81; 16 -8.89,3.81
DB9 = drill 1.016 pad 1.88 square: 1 -5.54,-1.42 | drill 1.016 pad 1.88: 2 -2.77,-1.42; 3 0,-1.42; 4 2.77,-1.42; 5 5.54,-1.42; 6 -4.15,1.42; 7 -1.38,1.42; 8 1.38,1.42; 9 4.15,1.42 | drill 3.302 pad 5.08: G1 -12.5,0; G2 12.5,0
SODIMM-CONNECTOR-2.5V = smd 0.35 x 2: 1 28.84,18.07; 2 28.54,9.87; 3 28.24,18.07; 4 27.94,9.87; 5 27.64,18.07; 6 27.34,9.87; 7 27.04,18.07; 8 26.74,9.87; 9 26.44,18.07; 10 26.14,9.87; 11 25.84,18.07; 12 25.54,9.87; 13 25.24,18.07; 14 24.94,9.87; 15 24.64,18.07; 16 24.34,9.87; 17 24.04,18.07; 18 23.74,9.87; 19 23.44,18.07; 20 23.14,9.87; 21 22.84,18.07; 22 22.54,9.87; 23 22.24,18.07; 24 21.94,9.87; 25 21.64,18.07; 26 21.34,9.87; 27 21.04,18.07; 28 20.74,9.87; 29 20.44,18.07; 30 20.14,9.87; 31 19.84,18.07; 32 19.54,9.87; 33 19.24,18.07; 34 18.94,9.87; 35 18.64,18.07; 36 18.34,9.87; 37 18.04,18.07; 38 17.74,9.87; 39 17.44,18.07; 40 17.14,9.87; 41 13.24,18.07; 42 12.94,9.87; 43 12.64,18.07; 44 12.34,9.87; 45 12.04,18.07; 46 11.74,9.87; 47 11.44,18.07; 48 11.14,9.87; 49 10.84,18.07; 50 10.54,9.87; 51 10.24,18.07; 52 9.94,9.87; 53 9.64,18.07; 54 9.34,9.87; 55 9.04,18.07; 56 8.74,9.87; 57 8.44,18.07; 58 8.14,9.87; 59 7.84,18.07; 60 7.54,9.87; 61 7.24,18.07; 62 6.94,9.87; 63 6.64,18.07; 64 6.34,9.87; 65 6.04,18.07; 66 5.74,9.87; 67 5.44,18.07; 68 5.14,9.87; 69 4.84,18.07; 70 4.54,9.87; 71 4.24,18.07; 72 3.94,9.87; 73 3.64,18.07; 74 3.34,9.87; 75 3.04,18.07; 76 2.74,9.87; 77 2.44,18.07; 78 2.14,9.87; 79 1.84,18.07; 80 1.54,9.87; 81 1.24,18.07; 82 0.94,9.87; 83 0.64,18.07; 84 0.34,9.87; 85 0.04,18.07; 86 -0.26,9.87; 87 -0.56,18.07; 88 -0.86,9.87; 89 -1.16,18.07; 90 -1.46,9.87; 91 -1.76,18.07; 92 -2.06,9.87; 93 -2.36,18.07; 94 -2.66,9.87; 95 -2.96,18.07; 96 -3.26,9.87; 97 -3.56,18.07; 98 -3.86,9.87; 99 -4.16,18.07; 100 -4.46,9.87; 101 -4.76,18.07; 102 -5.06,9.87; 103 -5.36,18.07; 104 -5.66,9.87; 105 -5.96,18.07; 106 -6.26,9.87; 107 -6.56,18.07; 108 -6.86,9.87; 109 -7.16,18.07; 110 -7.46,9.87; 111 -7.76,18.07; 112 -8.06,9.87; 113 -8.36,18.07; 114 -8.66,9.87; 115 -8.96,18.07; 116 -9.26,9.87; 117 -9.56,18.07; 118 -9.86,9.87; 119 -10.16,18.07; 120 -10.46,9.87; 121 -10.76,18.07; 122 -11.06,9.87; 123 -11.36,18.07; 124 -11.66,9.87; 125 -11.96,18.07; 126 -12.26,9.87; 127 -12.56,18.07; 128 -12.86,9.87; 129 -13.16,18.07; 130 -13.46,9.87; 131 -13.76,18.07; 132 -14.06,9.87; 133 -14.36,18.07; 134 -14.66,9.87; 135 -14.96,18.07; 136 -15.26,9.87; 137 -15.56,18.07; 138 -15.86,9.87; 139 -16.16,18.07; 140 -16.46,9.87; 141 -16.76,18.07; 142 -17.06,9.87; 143 -17.36,18.07; 144 -17.66,9.87; 145 -17.96,18.07; 146 -18.26,9.87; 147 -18.56,18.07; 148 -18.86,9.87; 149 -19.16,18.07; 150 -19.46,9.87; 151 -19.76,18.07; 152 -20.06,9.87; 153 -20.36,18.07; 154 -20.66,9.87; 155 -20.96,18.07; 156 -21.26,9.87; 157 -21.56,18.07; 158 -21.86,9.87; 159 -22.16,18.07; 160 -22.46,9.87; 161 -22.76,18.07; 162 -23.06,9.87; 163 -23.36,18.07; 164 -23.66,9.87; 165 -23.96,18.07; 166 -24.26,9.87; 167 -24.56,18.07; 168 -24.86,9.87; 169 -25.16,18.07; 170 -25.46,9.87; 171 -25.76,18.07; 172 -26.06,9.87; 173 -26.36,18.07; 174 -26.66,9.87; 175 -26.96,18.07; 176 -27.26,9.87; 177 -27.56,18.07; 178 -27.86,9.87; 179 -28.16,18.07; 180 -28.46,9.87; 181 -28.76,18.07; 182 -29.06,9.87; 183 -29.36,18.07; 184 -29.66,9.87; 185 -29.96,18.07; 186 -30.26,9.87; 187 -30.56,18.07; 188 -30.86,9.87; 189 -31.16,18.07; 190 -31.46,9.87; 191 -31.76,18.07; 192 -32.06,9.87; 193 -32.36,18.07; 194 -32.66,9.87; 195 -32.96,18.07; 196 -33.26,9.87; 197 -33.56,18.07; 198 -33.86,9.87; 199 -34.16,18.07; 200 -34.46,9.87 | smd 4.5 x 4.6: M1 29.74,1.97; M2 -35.36,1.97 | drill 3.75 pad 7: P$1 -33.02,-16.192; P$2 27.622,-16.192 | hole 0.6: 30.59,13.97 | hole 1.1: -36.21,13.97
FTDI_DEVICE_SIDE = drill 1.016 pad 1.88 square: P$1 -6.35,0 | drill 1.016 pad 1.88: P$2 -3.81,0; P$3 -1.27,0; P$4 1.27,0; P$5 3.81,0; P$6 6.35,0
2X3-NS = drill 1.016 pad 1.88 square: 1 -2.54,-1.27 | drill 1.016 pad 1.88 octagon: 2 -2.54,1.27; 3 0,-1.27; 4 0,1.27; 5 2.54,-1.27; 6 2.54,1.27
JTAG-ARM = drill 1: 1 -11.43,-1.27 | drill 1 octagon: 2 -11.43,1.27; 3 -8.89,-1.27; 4 -8.89,1.27; 5 -6.35,-1.27; 6 -6.35,1.27; 7 -3.81,-1.27; 8 -3.81,1.27; 9 -1.27,-1.27; 10 -1.27,1.27; 11 1.27,-1.27; 12 1.27,1.27; 13 3.81,-1.27; 14 3.81,1.27; 15 6.35,-1.27; 16 6.35,1.27; 17 8.89,-1.27; 18 8.89,1.27; 19 11.43,-1.27; 20 11.43,1.27
RGBLED_PLCC4 = smd 1.1 x 1: 1 -1.4,0.6; 2 -1.4,-0.6; 3 1.4,-0.6; 4 1.4,0.6
CHIPLED_1206 = smd 1.5 x 1.5: A 0,-1.496; C 0,1.496
RTRIM3296W = drill 0.61: 1 0,-2.54; 2 0,0; 3 0,2.54
ALPS_POT = drill 1 pad 1.88 square: P$1 7,-2.5; P$2 7,0; P$3 7,2.5 | drill 2 octagon: P$4 0,-4.4; P$5 0,4.4
B3F-10XX = drill 1.016 long: 1 -3.251,2.261; 2 3.251,2.261; 3 -3.251,-2.261; 4 3.251,-2.261
EG1218 = drill 0.9 pad 1.676: O -2.54,0; P 0,0; S 2.54,0
DPDT_SMT_JS202011SCQN = smd 1.2 x 2.5: P$1 -2.5,-4; P$2 0,-4; P$3 2.5,-4; P$4 2.5,4; P$5 0,4; P$6 -2.5,4
ARDUINOR3 = drill 1 pad 1.676 octagon: 3V 35.56,2.54; 5V 38.1,2.54; A0 50.8,2.54; A1 53.34,2.54; A2 55.88,2.54; A3 58.42,2.54; A4 60.96,2.54; A5 63.5,2.54; AREF 23.876,50.8; D0 63.5,50.8; D1 60.96,50.8; D2 58.42,50.8; D3 55.88,50.8; D4 53.34,50.8; D5 50.8,50.8; D6 48.26,50.8; D7 45.72,50.8; D8 41.656,50.8; D9 39.116,50.8; D10 36.576,50.8; D11 34.036,50.8; D12 31.496,50.8; D13 28.956,50.8; GND 26.416,50.8; GND1 43.18,2.54; GND2 40.64,2.54; IOREF 30.48,2.54; RESERVED 27.94,2.54; RESET 33.02,2.54; SCL 18.796,50.8; SDA 21.336,50.8; VIN 45.72,2.54
SOT223-R = smd 1.3 x 1.3: 1 -2.3,-3.05; 2 0,-3.05; 3 2.3,-3.05 | smd 3.6 x 1.3: 4 0,3.05
LOPY = drill 1 octagon: 3,3V 10.16,12.7; 5 10.16,-15.24; 5V 10.16,17.78; 6 10.16,-12.7; 7 10.16,-10.16; 8 10.16,-7.62; 9 -10.16,17.78; 10 10.16,-2.54; 11 10.16,-5.08; 12 10.16,0; 13 10.16,2.54; 14 10.16,7.62; 15 10.16,5.08; 16 -10.16,0; 17 10.16,10.16; 18 -10.16,-7.62; 20 -10.16,-10.16; 21 -10.16,5.08; 22 -10.16,-5.08; 23 -10.16,10.16; 24 -10.16,7.62; 34 -10.16,2.54; 38 -10.16,-2.54; 39 -10.16,-12.7; 40 -10.16,15.24; 41 -10.16,12.7; 42 -10.16,-15.24; GND 10.16,15.24
AUDIO-JACK = drill 1.3 pad 2.184: RING 5,5; RSH 5,2.5; SLEEVE 0,0; TIP 5,-5; TSH 5,-2.5 | hole 1.2: 0,5; -2.5,5; -2.5,-5; 0,-5; 5,0
SOIC127P600X175-8N = smd 1.981 x 0.559: 1 -2.464,1.905; 2 -2.464,0.635; 3 -2.464,-0.635; 4 -2.464,-1.905; 5 2.464,-1.905; 6 2.464,-0.635; 7 2.464,0.635; 8 2.464,1.905
MICROSD = smd 0.7 x 1.5: 1 9,-10.64; 2 7.9,-10.24; 3 6.8,-10.64; 4 5.7,-11.04; 5 4.6,-10.64; 6 3.5,-11.04; 7 2.4,-10.64; 8 1.3,-10.64 | smd 1.8 x 1.4: CD1 2,-0.44; CD2 8,-0.44 | smd 1.4 x 1.9: MT1 0.4,-13.54; MT2 13.6,-14.44
43045-0400 = drill 1.02 square: P$1 1.5,4.32 | drill 1.02: P$2 -1.5,4.32; P$3 1.5,7.32; P$4 -1.5,7.32 | hole 3: 0,0
TSSOP28 = smd 0.305 x 0.991: 1 -4.225,-2.918; 2 -3.575,-2.918; 3 -2.925,-2.918; 4 -2.275,-2.918; 5 -1.625,-2.918; 6 -0.975,-2.918; 7 -0.325,-2.918; 8 0.325,-2.918; 9 0.975,-2.918; 10 1.625,-2.918; 11 2.275,-2.918; 12 2.925,-2.918; 13 3.575,-2.918; 14 4.225,-2.918; 15 4.225,2.918; 16 3.575,2.918; 17 2.925,2.918; 18 2.275,2.918; 19 1.625,2.918; 20 0.975,2.918; 21 0.325,2.918; 22 -0.325,2.918; 23 -0.975,2.918; 24 -1.625,2.918; 25 -2.275,2.918; 26 -2.925,2.918; 27 -3.575,2.918; 28 -4.225,2.918
057-014-1 = drill 1 octagon: 1 -7.62,-1.27; 2 -7.62,1.27; 3 -5.08,-1.27; 4 -5.08,1.27; 5 -2.54,-1.27; 6 -2.54,1.27; 7 0,-1.27; 8 0,1.27; 9 2.54,-1.27; 10 2.54,1.27; 11 5.08,-1.27; 12 5.08,1.27; 13 7.62,-1.27; 14 7.62,1.27
B35N61 = drill 1.2: 1 0,0 | drill 1.3: 2 3.099,3.099; 3 -3.099,3.099; 4 -3.099,-3.099; 5 3.099,-3.099
XBEE-PRO = drill 0.8 pad 1.27: 1 -11,9; 2 -11,7; 3 -11,5; 4 -11,3; 5 -11,1; 6 -11,-1; 7 -11,-3; 8 -11,-5; 9 -11,-7; 10 -11,-9; 11 11,-9; 12 11,-7; 13 11,-5; 14 11,-3; 15 11,-1; 16 11,1; 17 11,3; 18 11,5; 19 11,7; 20 11,9

### Placement (x,y rotation side)
C1  155.73,87.63 180 top
C2  155.73,78.42 180 top
C3  149.7,75.72 180 top
C4  88.74,35.88 270 top
C5  33.81,90.01 180 bottom
C6  149.54,66.52 180 top
C7  104.93,78.11 90 top
C8  127,77.31 0 top
C50  37.31,75.88 90 top
CN1  39.21,95.89 180 top
CN2  147,103.35 180 top
DIS1  139.22,63.82 0 top
H1  5.24,12.38 0 top
H2  155.89,95.89 0 top
H3  155.89,4.13 0 top
H6  4.13,86.68 0 top
IC1  135.1,71.28 0 top
IC2  113.82,71.28 0 top
J1  86.68,90.65 0 top
J3  20,32.38 270 top
J4  58.1,97.79 0 top
J5  65.72,80.64 0 top
JTAG1  16.67,95.41 180 top
LED1  102.71,27.62 180 top
LED2  102.71,30.96 180 top
LED3  102.71,34.29 180 top
LED4  102.71,37.62 180 top
LED5  102.71,40.96 180 top
LED6  154.46,16.67 180 top
LED7  157.32,16.67 180 top
LED8  101.44,19.53 90 top
LED9  94.46,19.53 90 top
LED10  87.47,19.53 90 top
LED11  80.49,19.53 90 top
LED12  73.18,19.53 90 top
LED13  65.25,19.53 90 top
LED14  57.15,19.53 90 top
LED15  49.37,19.53 90 top
R1  96.2,77.31 180 top
R2  157.48,21.43 90 top
R3  155.89,21.43 90 top
R4  2.38,23.02 180 bottom
R5  2.38,21.75 180 bottom
R6  2.38,28.42 180 bottom
R7  34.61,87.95 90 bottom
R8  2.38,20.48 180 bottom
R9  88.74,32.7 90 top
R10  90.33,40.32 90 top
R11  91.6,40.32 90 top
R12  80.49,13.97 0 top
R13  87.47,13.97 0 top
R14  94.46,13.97 0 top
R15  101.44,13.97 0 top
R16  101.44,21.43 180 top
R17  94.46,21.43 180 top
R18  87.31,21.43 180 top
R19  80.49,21.43 180 top
R20  73.18,21.43 180 top
R21  65.25,21.43 180 top
R22  2.38,27.15 180 bottom
R23  57.15,21.43 180 top
R24  49.37,21.43 180 top
R25  124.62,25.72 0 top
R26  33.02,87.95 270 bottom
R27  127.79,25.72 0 top
RV1  111.28,5.24 90 top
RV2  122.87,5.24 90 top
RV3  134.46,5.24 90 top
RV4  146.05,5.24 90 top
S1  80.49,8.73 90 top
S2  87.47,8.73 90 top
S3  94.46,8.73 90 top
S4  101.44,8.73 90 top
S5  49.37,9.05 270 top
S6  57.31,9.05 270 top
S7  65.25,9.05 270 top
S8  73.18,9.05 270 top
SW1  33.81,84.61 90 top
U1  93.66,15.72 90 top
U2  155.73,83.03 90 top
U3  149.7,71.12 90 top
U4  132.08,34.13 90 top
U5  122.56,96.52 270 top
U6  109.38,96.52 270 top
U10  33.81,75.88 90 top
U$2  15.72,29.69 270 top
U$21  134.78,97 180 top
U$30  94.46,34.29 0 top
X1  58.1,91.92 0 top
X2  13.18,79.53 0 top
XB1  144.46,31.59 270 top

### Tracks (layer width: path | path; a pad name or v marks a point on that pad's centre or on a via)
2  (via drill 0.33)
  Top 0.305: v35.56,50.64 35.86,50.34 J3.145
  Bottom 0.305: U1.D2 41.59,72.87 41.59,71.12 39.69,69.22 39.69,62.23 37.78,60.33 37.78,50.96 37.62,50.8 35.72,50.8 v35.56,50.64
3  (via drill 0.33)
  Top 0.305: v35.88,49.05 36.83,49.05 36.92,49.15 J3.141
  Bottom 0.305: U1.D3 40.16,68.9 40.16,61.91 38.26,60.01 38.26,50.48 38.1,50.32 36.2,50.32 35.88,50.01 v35.88,49.05
3.3V  (via drill 0.6)
  Top 0.305: C4.1 89.31,37.21 U$30.28 90.23,38.04 89.53,38.73 89.53,40.29 R10.2 R11.2 | C50.1 37.27,75.09 34.45,75.09 34.45,75.25
  Top 0.406: U$2.4 1.76,23.99 v1.62,24.13 | J3.197 J3.199 38.07,66.2 37.47,66.2
  Top 0.61: 153.51,42.64 XB1.1 157,46.13 157,78.36 | S5.O S6.O S7.O S8.O 74.61,11.59 77.47,8.73 81.28,8.73 | 88.27,8.73 81.28,8.73 | 95.25,8.73 88.27,8.73 | 102.23,8.73 95.25,8.73 | 102.23,8.73 v108.27,8.73 | R12.2 81.25,8.76 81.28,8.73 | R13.2 88.23,8.76 88.27,8.73 | R14.2 95.22,8.76 95.25,8.73 | R15.2 102.2,8.76 102.23,8.73 | 105.25,34.77 105.25,31.59 105.22,31.56 | 105.25,34.77 105.25,38.1 | 105.22,31.56 LED2.2 | LED3.2 105.13,34.89 105.25,34.77 | LED4.2 105.13,38.22 105.25,38.1 | 158.62,83.19 U2.2 v157,83.03 157,78.36 | C2.1 157,78.36 | LED1.2 104.9,28.22 105.25,28.57 105.25,31.52 105.22,31.56 | 105.25,38.1 105.25,41.59 | 105.25,41.59 105.22,41.56 LED5.2 | 92.71,46.2 U1.IOREF | 92.71,46.2 99.47,46.2 102.81,42.86 105.25,42.86 | R11.2 91.89,41.08 92.71,41.91 92.71,46.2 | 92.71,46.2 92.71,49.69 U1.3V | 105.25,41.59 105.25,42.86 | v35.24,70.17 34.45,70.96 U10.3 34.45,75.25 33.81,75.88 31.43,75.88 29.84,77.47 v29.84,80.49 | v35.88,65.09 35.88,65.41 36.67,66.2 37.47,66.2 | v122.24,41.43 120.81,42.86 105.25,42.86
  Bottom 0.61: R6.1 R22.1 v1.62,24.13 R4.1 R5.1 R8.1 1.59,20.45 1.59,19.05 3.02,17.62 8.57,17.62 14.61,11.59 S5.O | 136.96,10.32 147.96,10.32 148.55,10.91 RV4.P$1 157.02,12.24 158.27,13.49 158.27,37.78 XB1.1 152.31,41.43 145.26,41.43 | 136.96,10.32 125.57,10.32 125.37,10.32 | 113.82,10.32 125.37,10.32 | 113.82,10.32 112.24,8.73 v108.27,8.73 | v122.24,41.43 145.26,41.43 | 29.84,93.19 29.05,93.19 JTAG1.2 JTAG1.1 | 29.84,93.19 X1.2 50.48,95.89 49.85,96.52 49.85,98.58 50.48,99.22 102.08,99.22 103.5,97.79 108.27,97.79 108.58,98.11 110.17,98.11 110.49,97.79 121.44,97.79 121.76,98.11 123.35,98.11 123.67,97.79 131.13,97.79 132.56,99.22 139.06,99.22 145.41,92.87 148.91,92.87 157,84.77 v157,83.03 | XB1.5 145.46,41.64 145.26,41.43 | v35.24,70.17 35.24,65.72 v35.88,65.09 | v29.84,80.49 29.84,93.19 | RV3.P$1 136.96,10.32 | RV2.P$1 125.37,10.32 | RV1.P$1 113.78,10.32 113.82,10.32
4  (via drill 0.33)
  Top 0.305: v36.51,49.69 36.57,49.74 J3.143
  Bottom 0.305: U1.D4 40.64,66.83 40.64,61.59 38.73,59.69 38.73,49.85 38.58,49.69 v36.51,49.69
5  (via drill 0.33)
  Top 0.305: v36.51,48.42 36.64,48.55 J3.139
  Bottom 0.305: U1.D5 41.12,64.77 41.12,61.28 39.21,59.37 39.21,48.9 38.89,48.58 36.67,48.58 v36.51,48.42
5.0V  (via drill 0.6)
  Top 0.305: X1.1 52.07,89.06 60.33,89.06 63.18,86.2 J5.2
  Top 0.406: IC2.16 96.52,75.09 R1.3
  Top 0.61: C8.1 126.21,77.28 IC1.16 | IC2.16 C7.1 107.79,77.34 DIS1.2 | v104.93,71.75 v120.17,71.75 v126.21,71.75 v141.45,71.75 | 140.97,71.75 v141.45,71.75 | C6.1 150.5,66.45 | v141.45,71.75 142.4,71.75 145.41,68.74 150.37,68.74 | 150.37,68.74 U3.2 | C6.1 150.56,68.55 150.37,68.74 | U1.5V 93.5,51.44 93.5,47.47 93.98,46.99 99.85,46.99 102.55,44.29 U4.5V 115.73,45.72 149.38,45.72 150.56,46.9 C6.1
  Bottom 0.406: J5.2 63.18,83.34 63.5,83.5 92.71,83.5 94.14,82.07 94.14,76.83 R1.3
  Bottom 0.61: IC2.10 v120.17,71.75 | v141.45,71.75 IC1.10 | IC1.16 v126.21,71.75 | v104.93,71.75 IC2.16
6  (via drill 0.33)
  Top 0.305: v40.48,40.64 39.99,40.15 J3.111
  Bottom 0.305: v40.48,40.64 40.64,40.8 40.64,54.45 42.23,56.04 43.81,56.04 44.61,56.83 44.61,62.23 U1.D6
7  (via drill 0.33)
  Top 0.305: v40.01,47.94 J3.137
  Bottom 0.305: U1.D7 40.16,58.74 40.16,48.1 v40.01,47.94
8  (via drill 0.33)
  Top 0.305: v39.53,47.31 39.49,47.34 J3.135
  Bottom 0.305: U1.D8 42.86,59.69 44.13,60.96 44.13,61.91 43.34,62.71 42.39,62.71 41.59,61.91 41.59,60.96 39.69,59.05 39.69,48.58 39.37,48.26 39.37,47.47 v39.53,47.31
9  (via drill 0.33)
  Top 0.305: v40.48,39.69 40.34,39.55 J3.109
  Bottom 0.305: U1.D9 41.12,53.09 41.12,40.32 v40.48,39.69
10  (via drill 0.33)
  Top 0.305: J3.63 41.56,25.75 v41.59,25.72
  Bottom 0.305: v41.59,25.72 41.59,51.02 U1.D10
12V  (via drill 0.6)
  Top 0.61: 152.75,73.69 U3.3 150.72,75.45 C3.1 | 150.76,75.72 C3.1 | X1.3 54.29,91.92 54.29,95.41 55.24,96.36 65.09,96.36 66.52,97.79 94.14,97.79 | C3.1 153.03,78.04 153.03,79.69 155.26,81.92 155.26,83.19 157.4,85.33 U2.3 158.78,85.6 C1.1 154.63,89.75 CN2.PWR 147,91.28 139.06,99.22 132.56,99.22 131.13,97.79 123.67,97.79 123.35,98.11 121.76,98.11 121.44,97.79 110.49,97.79 110.17,98.11 108.58,98.11 108.27,97.79 94.14,97.79 | U1.VIN 94.14,64.45 v94.14,92.55 | v94.14,96.36 94.14,97.79
  Bottom 0.61: v94.14,92.55 v94.14,96.36
_N
  Top 0.305: J3.74 31.02,29.05 31.11,29.14 31.66,29.14 arc90 32.3,29.78 32.3,63.62 arc-45 32.48,64.07 39.73,71.32 arc45 39.91,71.77 39.91,90.33 arc45 40.01,90.56 CN1.D-
_P
  Top 0.305: J3.76 31.07,29.64 31.11,29.6 31.59,29.6 arc90 31.84,29.84 31.84,63.81 arc-45 32.03,64.26 39.27,71.5 arc45 39.46,71.95 39.46,90.33 39.4,90.39 arc-45 39.21,90.84 CN1.D+
A0
  Top 0.305: U1.A0 81.76,57.15 45.4,57.15 45.24,56.99 45.24,55.88 44.77,55.4 44.77,53.98 44.13,53.34 44.13,51.75 43.33,50.95 J3.147
A1
  Top 0.305: J3.149 40.27,51.55 42.23,53.5 43.5,53.5 44.29,54.29 44.29,55.72 44.77,56.2 44.77,57.31 45.09,57.63 81.44,57.63 89.85,66.04 89.85,67.79 U1.A1
A2
  Top 0.305: J3.151 40.08,52.15 41.59,53.66 41.59,55.24 42.39,56.04 43.81,56.04 44.29,56.52 44.29,57.63 44.77,58.1 81.12,58.1 89.38,66.36 89.38,69.85 U1.A2
A3
  Top 0.305: J3.153 39.89,52.74 41.12,53.98 41.12,57.31 42.39,58.58 80.8,58.58 88.9,66.67 88.9,71.91 U1.A3
A4
  Top 0.305: J3.155 39.69,53.34 40.64,54.29 40.64,57.63 42.07,59.05 80.49,59.05 88.42,66.99 88.42,73.98 U1.A4
A5
  Top 0.305: J3.157 39.5,53.95 40.16,54.61 40.16,57.94 41.75,59.53 80.17,59.53 87.95,67.31 87.95,76.04 U1.A5
CAN_N  (via drill 0.3)
  Top 0.305: 108.11,94.55 v108.11,94.4 | 87.31,94.55 57.31,94.55 arc90 57.06,94.3 57.06,92.39 arc90 57.31,92.14 57.85,92.14 arc90 58.1,92.39 X1.8 | U10.6 34.45,78.7 arc45 34.26,79.15 34.04,79.38 34.04,84.61 v34.19,84.61 SW1.P$2 | v87.31,94.4 87.31,94.55 | 87.31,94.55 108.11,94.55 | v121.28,94.4 121.28,94.55 | 121.28,94.55 108.11,94.55 | U$21.P$3 134.22,89.68 arc90 134.55,90.01 134.55,94.3 arc90 134.3,94.55 121.28,94.55
  Bottom 0.305: U6.TIP 105.7,92.84 arc-45 106.15,93.03 109.15,93.03 109.15,94.3 arc90 108.9,94.55 108.11,94.55 v108.11,94.4 | U5.TIP 118.88,92.84 arc-45 119.33,93.03 122.33,93.03 122.33,94.3 arc90 122.08,94.55 121.28,94.55 v121.28,94.4 | J1.2 84.2,89.23 arc45 84.65,89.41 86.4,91.16 arc45 86.59,91.61 86.59,94.3 arc-90 86.84,94.55 87.31,94.55 v87.31,94.4 | v34.19,84.61 34.04,84.61 34.04,85.41 arc-90 34.29,85.66 58.97,85.66 arc90 59.6,86.29 59.6,91.51 arc90 58.97,92.14 58.35,92.14 arc-90 58.1,92.39 X1.8
CAN_P  (via drill 0.3)
  Top 0.305: 121.28,95 v121.28,95.15 | 108.11,95 v108.11,95.15 | 87.31,95 57.24,95 arc90 56.6,94.37 56.6,92.32 arc90 57.24,91.69 57.85,91.69 arc-90 58.1,91.44 X1.7 | U10.7 33.18,78.7 arc-45 33.37,79.15 33.59,79.38 33.59,84.61 v33.44,84.61 SW1.P$5 | v87.31,95.15 87.31,95 | 87.31,95 108.11,95 | 121.28,95 108.11,95 | U$21.P$4 135.34,89.68 arc-90 135.01,90.01 135.01,94.3 arc90 134.3,95 121.28,95
  Bottom 0.305: U6.RING 113.06,92.84 arc45 112.61,93.03 109.61,93.03 109.61,94.37 arc90 108.97,95 108.11,95 v108.11,95.15 | U5.RING 126.23,92.84 arc45 125.78,93.03 122.78,93.03 122.78,94.37 arc90 122.15,95 121.28,95 v121.28,95.15 | J1.7 85.95,92.72 arc45 86.13,93.16 86.13,94.37 arc-90 86.77,95 87.31,95 v87.31,95.15 | v33.44,84.61 33.59,84.61 33.59,85.48 arc-90 34.22,86.11 58.9,86.11 arc90 59.15,86.36 59.15,91.44 arc90 58.9,91.69 58.35,91.69 arc90 58.1,91.44 X1.7
CAN_RX  (via drill 0.33)
  Top 0.305: J3.93 36.53,34.74 36.35,34.92 v35.56,34.92 | v35.72,71.91 U10.4
  Bottom 0.305: v35.56,34.92 33.81,34.92 33.34,35.4 33.34,66.99 31.27,69.06 31.27,71.6 31.59,71.91 v35.72,71.91
CAN_TX  (via drill 0.33)
  Top 0.305: v31.91,71.28 U10.1 | J3.95 36.89,35.34 36.67,35.56 v36.2,35.56
  Bottom 0.305: v36.2,35.56 33.97,35.56 33.81,35.72 33.81,67.31 31.91,69.22 v31.91,71.28
CTS  (via drill 0.33)
  Top 0.305: J3.99 39.34,36.55 39.53,36.35 39.53,30.48 40.96,29.05 v43.81,29.05 | v90.01,24.29 109.38,24.29 v109.86,23.81
  Bottom 0.305: v43.81,29.05 85.25,29.05 v90.01,24.29 | v109.86,23.81 111.76,23.81 113.51,22.07 135.99,22.07 XB1.12
DAC0
  Top 0.305: J3.3 34.43,4.14 33.97,4.6 33.97,16.83 33.34,17.46 14.29,17.46 13.18,18.57 X2.1
DBG_RX  (via drill 0.33)
  Top 0.305: J3.67 43.77,26.95 v43.81,26.99 | v46.04,26.99 56.2,37.15 v56.2,56.52 | v54.29,90.49 54.29,90.96 55.56,92.23 X1.6 | v56.2,60.17 56.2,87.79 v55.56,88.42
  Bottom 0.305: X1.6 55.56,96.52 J4.P$3 | v43.81,26.99 v46.04,26.99 | v56.2,56.52 v56.2,60.17 | v55.56,88.42 54.29,89.69 v54.29,90.49
DBG_TX  (via drill 0.33)
  Top 0.305: J3.65 43.66,26.34 v43.81,26.19 | v46.04,26.19 46.35,26.19 46.67,26.51 46.67,26.83 56.67,36.83 56.67,56.04 56.99,56.36 v56.99,56.52 | v56.99,60.17 56.99,60.33 56.67,60.64 v56.67,88.42
  Bottom 0.305: J4.P$2 54.29,91.92 X1.5 56.67,89.53 v56.67,88.42 | v43.81,26.19 v46.04,26.19 | v56.99,56.52 v56.99,60.17
GND  (via drill 0.33)
  other vias: 129.38,77.15 133.83,76.99 34.61,30.32 34.61,33.97 28.1,30.48
  pour Top (rank 2): 0,0 160.02,0 160.02,100.01 0,100.01
  pour Bottom: 0,100.01 160.02,100.01 160.02,0 0,0
JTAG_TCK
  Top 0.305: J3.84 27.8,32.05 26.67,33.18 26.67,89.69 23.97,92.39 20.48,92.39 19.21,93.66 19.21,95.41 JTAG1.9
JTAG_TDI
  Top 0.305: J3.86 28,32.65 27.15,33.5 27.15,90.01 24.29,92.87 22.54,92.87 21.75,93.66 21.75,95.41 JTAG1.5
JTAG_TDO
  Top 0.305: J3.88 28.19,33.24 27.62,33.81 27.62,90.33 24.29,93.66 24.29,97.47 23.97,97.79 13.97,97.79 JTAG1.13
JTAG_TMS  (via drill 0.33)
  Top 0.305: J3.82 27.61,31.45 26.19,32.86 26.19,89.38 23.81,91.76 v23.65,91.76
  Bottom 0.305: v23.65,91.76 21.75,93.66 21.75,95.41 JTAG1.7
LCD_LATCH  (via drill 0.33)
  Top 0.305: v115.09,73.34 v136.37,73.34 | J3.41 44.39,19.14 45.88,20.64 45.88,24.92 62.55,41.59 v88.74,41.59
  Bottom 0.254: 113.82,65.72 113.82,65.88
  Bottom 0.305: IC2.12 v115.09,73.34 113.82,72.07 113.82,65.88 | v136.37,73.34 IC1.12 | v88.74,41.59 94.46,41.59 97,44.13 97,48.9 113.82,65.72
LED1  (via drill 0.33)
  Top 0.305: J3.75 39.23,29.34 40.64,27.94 v43.81,27.94 | v89.85,22.38 99.73,22.38 R16.2
  Bottom 0.305: v43.81,27.94 84.3,27.94 v89.85,22.38
LED2  (via drill 0.33)
  Top 0.305: J3.61 39.91,25.14 40.01,25.24 40.64,25.24 40.8,25.08 42.7,25.08 v42.86,25.24 | v89.85,21.43 R17.2
  Bottom 0.305: v42.86,25.24 86.04,25.24 v89.85,21.43
LED3  (via drill 0.33)
  Top 0.305: J3.59 40.26,24.55 v40.32,24.61 | v85.41,21.43 R18.2
  Bottom 0.305: v40.32,24.61 82.23,24.61 v85.41,21.43
LED4  (via drill 0.33)
  Top 0.305: J3.57 40.77,23.95 v40.8,23.97 | v78.58,21.43 R19.2
  Bottom 0.305: v40.8,23.97 41.12,23.97 41.27,24.13 75.88,24.13 v78.58,21.43
LED5  (via drill 0.33)
  Top 0.305: J3.55 41.44,23.34 v41.59,23.5 | v71.28,21.43 R20.2
  Bottom 0.305: v41.59,23.5 69.22,23.5 v71.28,21.43
LED6  (via drill 0.33)
  Top 0.305: J3.53 42.11,22.75 v42.23,22.86 | v63.34,21.43 R21.2
  Bottom 0.305: v42.23,22.86 61.91,22.86 v63.34,21.43
LED7  (via drill 0.33)
  Top 0.305: J3.51 42.78,22.14 v42.86,22.23 | v55.24,21.43 R23.2
  Bottom 0.305: v42.86,22.23 54.45,22.23 v55.24,21.43
LED8  (via drill 0.33)
  Top 0.305: J3.49 43.45,21.55 v43.5,21.59 | v47.47,21.43 R24.2
  Bottom 0.305: v43.5,21.59 47.31,21.59 v47.47,21.43
MISO  (via drill 0.33)
  Top 0.305: X1.12 62.07,92.08 62.07,90.17 64.45,87.79 64.45,80.8 63.98,80.33 63.98,80.17 J5.1 | J3.45 44,20.34 44.93,21.27 44.93,45.15 U1.D12 | v63.02,47.94 v63.02,49.85 63.02,50.01
  Bottom 0.305: J5.1 63.18,50.01 v63.02,49.85 | v63.02,47.94 62.29,47.21 U1.D12
MOSI  (via drill 0.3, 0.33)
  Top 0.305: J3.47 43.8,20.95 44.45,21.59 44.45,42.23 43.34,43.34 41.59,43.34 41.12,43.81 41.12,48.01 U1.D11 | X1.11 65.72,88.11 v65.72,84.3 J5.4 | v131.29,82.39 IC1.14
  Bottom 0.305: J5.4 65.72,81.28 64.45,80.01 64.45,78.26 63.66,77.47 63.66,49.53 61.91,47.78 44.83,47.78 U1.D11 | v131.29,82.39 118.27,82.39 118.11,82.23 97.79,82.23 94.93,85.09 66.52,85.09 v65.72,84.3
N$1
  Bottom 0.305: IC1.15 128.75,80.33 128.27,80.8 123.95,80.8 DIS1.7
N$2
  Bottom 0.305: DIS1.8 125,70.1 126.21,68.9 IC1.1
N$3  (via drill 0.33)
  Top 0.305: SW1.P$3 37.77,87.15 v36.04,87.15
  Bottom 0.305: v36.04,87.15 34.64,87.15 arc-90 R7.1
N$4
  Bottom 0.305: DIS1.9 127.54,70.1 128.75,68.9 IC1.2
N$5  (via drill 0.33)
  Top 0.305: v31.59,87.15 29.85,87.15 arc90 SW1.P$4
  Bottom 0.305: v31.59,87.15 32.99,87.15 arc90 R26.2
N$6
  Bottom 0.305: DIS1.10 130.08,70.1 131.29,68.9 IC1.3
N$7
  Bottom 0.305: DIS1.11 132.62,70.1 133.83,68.9 IC1.4
N$8
  Bottom 0.305: 33.81,88.71 R26.1 | 33.81,88.71 R7.2 | C5.1 33.81,89.25 33.81,88.71
N$9
  Bottom 0.305: DIS1.12 135.16,70.1 136.37,68.9 IC1.5
N$10
  Top 0.305: U$30.6 93.48,30.5 96.52,27.46 99.22,27.46 100.49,26.19 102.39,26.19 103.19,26.99 104.08,26.99 LED1.1
N$11
  Bottom 0.406: R1.2 103.98,77.31 104.78,78.11 111.09,78.11 DIS1.3
N$12
  Top 0.305: R16.1 102.94,20.7 LED8.A
N$13
  Top 0.305: U$30.7 94.13,30.65 96.84,27.94 99.69,27.94 100.49,27.15 101.19,27.15 LED1.4
N$14
  Top 0.305: U$30.8 94.78,30.79 97.16,28.42 101.12,28.42 LED1.3
N$15
  Top 0.305: R17.1 95.95,20.7 LED9.A
N$16
  Top 0.305: 155.89,20.39 R3.1 155.89,19.59 LED6.A
N$17
  Top 0.305: XB1.15 145.06,22.19 R3.2
N$18  (via drill 0.33)
  Top 0.305: XB1.6 v145.89,40.16 | v147.32,38.73 157.48,28.57 R2.2
  Bottom 0.305: v145.89,40.16 v147.32,38.73
N$19
  Top 0.305: R2.1 157.48,18.16 LED7.A
N$20
  Top 0.305: U$30.9 95.43,30.93 97.31,29.05 99.85,29.05 100.17,29.37 102.23,29.37 103.19,30.32 104.08,30.32 LED2.1
N$21
  Top 0.305: U$30.11 96.73,30.43 97.63,29.53 99.54,29.53 100.36,30.36 LED2.4
N$22
  Top 0.305: U$30.12 97.38,30.57 97.95,30 99.22,30 100.77,31.56 LED2.3
N$23
  Bottom 0.305: DIS1.13 137.7,70.1 138.91,68.9 IC1.6
N$24
  Bottom 0.305: DIS1.14 140.24,70.1 141.45,68.9 IC1.7
N$25
  Top 0.305: R18.1 88.97,20.54 LED10.A
N$26
  Top 0.305: R19.1 81.98,20.7 LED11.A
N$27
  Bottom 0.305: IC2.14 110.01,76.68 110.33,76.99 113.35,76.99 114.3,77.95 115.25,77.95 116.05,78.74 116.05,80.01 116.68,80.64 123.03,80.64 123.67,81.28 140.02,81.28 141.45,79.85 141.45,78.58 142.56,77.47 143.19,77.47 143.99,76.68 IC1.9
N$28
  Bottom 0.305: IC2.15 107.47,76.68 108.27,77.47 113,77.47 DIS1.4
N$29
  Top 0.305: U$30.13 98.03,30.71 98.27,30.48 98.9,30.48 99.22,30.8 99.22,31.59 100.33,32.7 102.08,32.7 103.06,33.69 LED3.1
N$30
  Top 0.305: U$30.14 98.68,32.96 99.41,33.69 LED3.4
N$31
  Top 0.305: R20.1 74.68,20.7 LED12.A
N$32
  Top 0.305: U$30.15 98.68,35.46 99.25,34.89 LED3.3
N$33
  Top 0.305: U$30.16 98.03,37.87 98.27,38.1 98.9,38.1 99.22,37.78 99.22,36.67 99.85,36.04 102.08,36.04 103.06,37.02 LED4.1
N$34
  Top 0.305: U$30.17 97.38,38.01 97.95,38.58 99.22,38.58 99.69,38.1 99.69,37.78 100.33,37.15 101.19,37.15 LED4.4
N$35
  Top 0.305: U$30.18 96.73,38.15 97.63,39.05 99.54,39.05 100.33,38.26 101.28,38.26 LED4.3
N$36
  Top 0.305: U$30.20 95.43,37.8 97.16,39.53 102.39,39.53 103.19,40.32 104.08,40.32 LED5.1
N$37
  Bottom 0.305: IC2.1 104.93,70.48 107.79,73.34 113.35,73.34 113.67,73.66 113.67,76.52 114.62,77.47 115.54,77.47 DIS1.5
N$38
  Top 0.305: U$30.21 94.78,37.95 96.84,40.01 100.96,40.01 LED5.4
N$39
  Top 0.305: U$30.22 94.13,38.09 96.52,40.48 99.69,40.48 100.49,41.27 101.03,41.27 LED5.3
N$40
  Bottom 0.305: IC2.2 107.47,70.48 109.86,72.87 113.67,72.87 114.14,73.34 114.14,76.2 114.94,76.99 116.05,76.99 117.16,78.11 118.71,78.11 DIS1.6
N$41
  Top 0.305: R21.1 66.74,20.7 LED13.A
N$42
  Top 0.305: R23.1 58.65,20.7 LED14.A
N$43
  Top 0.305: R24.1 50.87,20.7 LED15.A
N$46
  Top 0.305: U4.41 120.49,25.08 122.08,25.08 122.71,25.72 R25.1
N$53
  Top 0.305: U$30.1 89.31,31.37 R9.1
N$79  (via drill 0.33)
  Top 0.305: 30.83,28.45 J3.72 31.46,28.45 31.59,28.57 arc90 32.86,29.84 32.86,63.4 arc-45 33.05,63.84 40.3,71.09 arc45 40.48,71.54 40.48,89.31 arc-45 v40.64,89.69 | v38.73,89.69 38.6,89.83 arc-45 38.41,90.28 CN1.ID
  Bottom 0.305: v40.64,89.69 v38.73,89.69
POT1
  Top 0.305: RV1.P$2 111.28,2.22 110.97,1.91 43.81,1.91 39.77,5.95 J3.9
POT2
  Top 0.305: RV2.P$2 122.87,1.75 122.56,1.43 43.5,1.43 39.58,5.34 J3.7
POT3
  Top 0.305: RV3.P$2 134.46,1.27 134.14,0.95 43.18,0.95 39.39,4.75 J3.5
POT4
  Top 0.305: J3.1 39.79,3.54 42.86,0.48 145.73,0.48 146.05,0.79 RV4.P$2
RESET
  Top 0.305: J3.90 28.39,33.84 28.1,34.13 28.1,90.65 26.83,91.92 26.83,97.95 26.51,98.27 11.91,98.27 JTAG1.15
RTS  (via drill 0.33)
  Top 0.305: J3.101 39.53,37.15 40.01,36.67 40.01,30.8 40.96,29.84 v43.81,29.84 | v90.01,25.24 90.49,24.77 v109.86,24.77
  Bottom 0.305: v43.81,29.84 85.41,29.84 v90.01,25.24 | v109.86,24.77 111.6,24.77 113.82,22.54 143.51,22.54 XB1.16
RX  (via drill 0.33)
  Top 0.305: v36.35,41.59 36.6,41.34 J3.115
  Bottom 0.305: U1.D1 41.12,74.93 41.12,71.44 39.21,69.53 39.21,62.55 37.31,60.64 37.31,51.75 36.83,51.28 35.24,51.28 34.92,50.96 34.92,43.02 v36.35,41.59
SCK  (via drill 0.3, 0.33)
  Top 0.305: v117.63,72.71 v138.91,72.71 | J5.3 66.99,80.64 v66.99,84.3 66.99,89.38 X1.13 | IC2.11 117.63,77.47 118.59,78.42 v118.59,81.76 | J3.43 44.19,19.75 45.4,20.95 45.4,46.35 43.34,48.42 42.23,48.42 41.59,47.78 41.59,45.94 U1.D13
  Bottom 0.305: IC2.11 v117.63,72.71 | v138.91,72.71 IC1.11 | J5.3 65.72,78.74 64.14,77.15 64.14,48.1 62.71,46.67 44.86,46.67 U1.D13 | v118.59,81.76 97.47,81.76 94.77,84.45 67.15,84.45 v66.99,84.3
SCL  (via drill 0.33)
  Top 0.305: J3.37 41.33,14.35 v41.43,14.45 | R11.1 91.53,39.49 U$30.26 91.53,35.97 v91.44,35.88 | v72.39,85.88 v72.39,82.39
  Bottom 0.305: v41.43,14.45 88.58,14.45 91.12,16.99 91.12,35.56 v91.44,35.88 91.44,37.94 90.49,38.89 88.27,38.89 87.63,39.53 87.63,68.1 73.34,82.39 v72.39,82.39 | v72.39,85.88 68.9,89.38 62.87,89.38 62.07,90.17 62.07,91.76 X1.10
SCL1
  Top 0.305: J3.117 40.76,41.95 41.12,41.59 41.12,37.94 41.59,37.47 41.59,35.78 U1.SCL
SD_IN  (via drill 0.38)
  Top 0.305: U$2.CD1 15.28,27.82 v16.51,29.05 | J3.73 34.76,28.75 v34.61,28.89
  Bottom 0.305: v34.61,28.89 34.45,29.05 v16.51,29.05
SDA  (via drill 0.33)
  Top 0.305: R10.1 90.88,39.01 U$30.27 90.88,36.27 v90.65,36.04 | v40.96,15.08 40.82,14.95 J3.39 | v71.6,82.39 v71.6,85.72
  Bottom 0.305: v40.96,15.08 41.75,15.08 41.91,14.92 88.27,14.92 90.65,17.3 v90.65,36.04 90.65,37.94 90.17,38.42 87.95,38.42 87.15,39.21 87.15,67.79 73.18,81.76 71.75,81.76 71.6,81.92 v71.6,82.39 | v71.6,85.72 71.6,85.88 68.58,88.9 62.39,88.9 X1.9
SDA1
  Top 0.305: U1.SDA 41.59,38.32 41.59,41.91 40.96,42.55 J3.119
SDIO_CMD  (via drill 0.33)
  Top 0.305: v6.35,22.86 5.1,22.86 U$2.3 | v33.18,22.86 33.18,28.57 33.81,29.05 33.81,34.61 35.24,36.2 36.67,36.2 36.92,35.95 J3.97
  Bottom 0.305: R4.2 6.19,23.02 v6.35,22.86 v33.18,22.86
SDIO_D0  (via drill 0.38)
  Top 0.305: J3.69 34.21,27.55 v33.97,27.3 | v6.35,27.3 5.09,27.3 U$2.7
  Bottom 0.305: v33.97,27.3 21.68,27.3 arc90 21.34,26.96 21.34,26.16 arc-90 21,25.82 20.98,25.82 arc-90 20.64,26.16 20.64,26.96 arc90 20.3,27.3 20.29,27.3 arc90 19.95,26.96 19.95,26.16 arc-90 19.61,25.82 19.6,25.82 arc-90 19.26,26.16 19.26,26.96 arc90 18.92,27.3 18.91,27.3 arc90 18.57,26.96 18.57,26.16 arc-90 18.23,25.82 18.21,25.82 arc-90 17.87,26.16 17.87,26.96 arc90 17.53,27.3 17.52,27.3 arc90 17.18,26.96 17.18,26.16 arc-90 16.84,25.82 16.83,25.82 arc-90 16.49,26.16 16.49,26.96 arc90 16.15,27.3 16.14,27.3 arc90 15.8,26.96 15.8,26.16 arc-90 15.46,25.82 15.44,25.82 arc-90 15.1,26.16 15.1,26.96 arc90 14.76,27.3 v6.35,27.3 6.19,27.15 R22.2
SDIO_D1  (via drill 0.38)
  Top 0.305: J3.71 34.09,28.14 v33.97,28.26 | v6.35,28.26 5.21,28.26 U$2.8
  Bottom 0.305: v33.97,28.26 15.4,28.26 arc-90 15.06,28.6 15.06,29.4 arc90 14.72,29.74 14.64,29.74 arc90 14.3,29.4 14.3,28.6 arc-90 13.96,28.26 13.88,28.26 arc-90 13.54,28.6 13.54,29.4 arc90 13.2,29.74 13.12,29.74 arc90 12.78,29.4 12.78,28.6 arc-90 12.44,28.26 12.37,28.26 arc-90 12.03,28.6 12.03,29.4 arc90 11.69,29.74 11.61,29.74 arc90 11.27,29.4 11.27,28.6 arc-90 10.93,28.26 10.85,28.26 arc-90 10.51,28.6 10.51,29.4 arc90 10.17,29.74 10.09,29.74 arc90 9.75,29.4 9.75,28.6 arc-90 9.41,28.26 9.33,28.26 arc-90 8.99,28.6 8.99,29.4 arc90 8.65,29.74 8.57,29.74 arc90 8.23,29.4 8.23,28.6 arc-90 7.89,28.26 v6.35,28.26 6.19,28.42 R6.2
SDIO_D2  (via drill 0.33)
  Top 0.305: v6.35,20.64 5.12,20.64 U$2.1 | J3.87 36.76,32.95 v36.51,32.7
  Bottom 0.305: R8.2 6.19,20.48 v6.35,20.64 36.2,20.64 36.51,20.95 v36.51,32.7
SDIO_D3  (via drill 0.33)
  Top 0.305: v6.67,21.75 5.51,21.75 U$2.2 | J3.89 36.35,33.55 v36.35,33.5
  Bottom 0.305: R5.2 v6.67,21.75 20.8,21.75 21,21.75 33.66,21.75 arc90 33.99,22.09 arc-90 34.34,22.43 34.44,22.43 arc-90 34.78,22.09 arc90 35.12,21.75 35.56,21.75 35.88,22.07 35.88,33.02 v36.35,33.5
SDIO_SCK  (via drill 0.33)
  Top 0.305: J3.91 36.18,34.15 v36.04,34.29 | v6.35,25.08 U$2.5
  Bottom 0.305: v36.04,34.29 35.72,34.29 35.4,33.97 35.4,25.4 35.08,25.08 25.91,25.08 arc-90 25.57,25.42 25.57,26.1 arc90 25.23,26.44 25.21,26.44 arc90 24.87,26.1 24.87,25.42 arc-90 24.53,25.08 24.52,25.08 arc-90 24.18,25.42 24.18,26.1 arc90 23.84,26.44 23.82,26.44 arc90 23.48,26.1 23.48,25.42 arc-90 23.14,25.08 23.12,25.08 arc-90 22.78,25.42 22.78,26.1 arc90 22.45,26.44 22.43,26.44 arc90 22.09,26.1 22.09,25.42 arc-90 21.75,25.08 v6.35,25.08
SW1
  Top 0.305: J3.25 41.33,10.74 46.35,5.71 46.99,5.71 47.31,6.03 47.31,8.73 47.62,9.05 S5.P
SW2
  Top 0.305: J3.23 41.13,10.14 46.04,5.24 54.93,5.24 55.24,5.56 55.24,8.73 55.56,9.05 S6.P
SW3
  Top 0.305: J3.21 40.94,9.54 45.72,4.76 62.87,4.76 63.18,5.08 63.18,8.73 63.5,9.05 S7.P
SW4
  Top 0.305: J3.19 40.74,8.95 45.4,4.29 70.8,4.29 71.12,4.6 71.12,8.73 71.44,9.05 S8.P
SW5
  Top 0.254: 78.26,12.02 S1.2
  Top 0.305: R12.1 78.74,13.97 78.26,13.49 78.26,12.02 | S1.1 78.23,3.93 78.11,3.81 45.09,3.81 40.55,8.35 J3.17
  Bottom 0.305: S1.1 S1.2
SW6
  Top 0.254: 85.25,12.02 S2.2
  Top 0.305: R13.1 85.72,13.97 85.25,13.49 85.25,12.02 | S2.1 85.21,3.77 84.77,3.33 44.77,3.33 40.36,7.75 J3.15
  Bottom 0.305: S2.1 S2.2
SW7
  Top 0.254: 92.23,12.02 S3.2
  Top 0.305: R14.1 92.71,13.97 92.23,13.49 92.23,12.02 | S3.1 92.2,3.3 91.76,2.86 44.45,2.86 40.16,7.14 J3.13
  Bottom 0.305: S3.1 S3.2
SW8
  Top 0.254: 99.22,12.02 S4.2
  Top 0.305: R15.1 99.69,13.97 99.22,13.49 99.22,12.02 | S4.1 99.18,2.82 98.74,2.38 53.5,2.38 53.34,2.38 44.13,2.38 39.97,6.54 J3.11
  Bottom 0.305: S4.1 S4.2
TELE_RX  (via drill 0.33)
  Top 0.305: J3.105 39.92,38.34 40.96,37.31 40.96,31.75 41.27,31.43 v43.81,31.43 | v90.01,27.15 91.44,25.72 108.11,25.72 108.58,26.19 109.38,26.19 110.01,25.56 121.76,25.56 123.59,27.38 | XB1.2 150.31,41.43 149.07,41.43 142.72,35.08 131.29,35.08 123.59,27.38 | 123.59,27.38 125.25,25.72 R25.2 R27.1
  Bottom 0.305: v43.81,31.43 85.72,31.43 v90.01,27.15
TELE_TX  (via drill 0.33)
  Top 0.305: J3.103 39.73,37.74 40.48,36.99 40.48,31.11 40.96,30.64 v43.81,30.64 | v90.01,26.19 90.96,25.24 108.43,25.24 108.74,25.56 v109.06,25.56 | XB1.3 142.43,35.56 130.97,35.56 121.6,26.19 v116.84,26.19
  Bottom 0.305: v43.81,30.64 85.57,30.64 v90.01,26.19 | v109.06,25.56 109.06,26.04 109.22,26.19 v116.84,26.19 U4.40
TX  (via drill 0.33)
  Top 0.305: v36.2,40.8 36.25,40.74 J3.113
  Bottom 0.305: U1.D0 41.59,77.95 41.59,76.2 40.64,75.25 40.64,71.75 38.73,69.85 38.73,62.87 36.83,60.96 36.83,52.07 36.51,51.75 34.92,51.75 34.45,51.28 34.45,42.55 v36.2,40.8
~RESET  (via drill 0.33)
  Top 0.305: v92.55,40.32 92.55,39.05 92.18,38.68 U$30.25 92.18,35.77 v92.23,35.72 | J3.35 40.87,13.74 v40.96,13.65
  Bottom 0.305: v88.58,40.32 v92.55,40.32 | v40.96,13.65 41.59,13.65 41.91,13.97 88.9,13.97 91.6,16.67 91.6,35.08 v92.23,35.72

### Text on the board
tPlace: TX | A5 | RX | A4 | 2 | A3 | 3 | A2 | 4 | A1 | 5 | A0 | 6 | 7 | Vin | GND | 8 | GND | 9 | 5V | 10 | 3.3V | 11 | NC | 12 | IOREF | 13 | NC | GND | NC | SDA | SCL